# EAGLE schematic Alcohol_Detector_Project_Schematic (EAGLE 9.6.2)

## Sheet 1 of 7
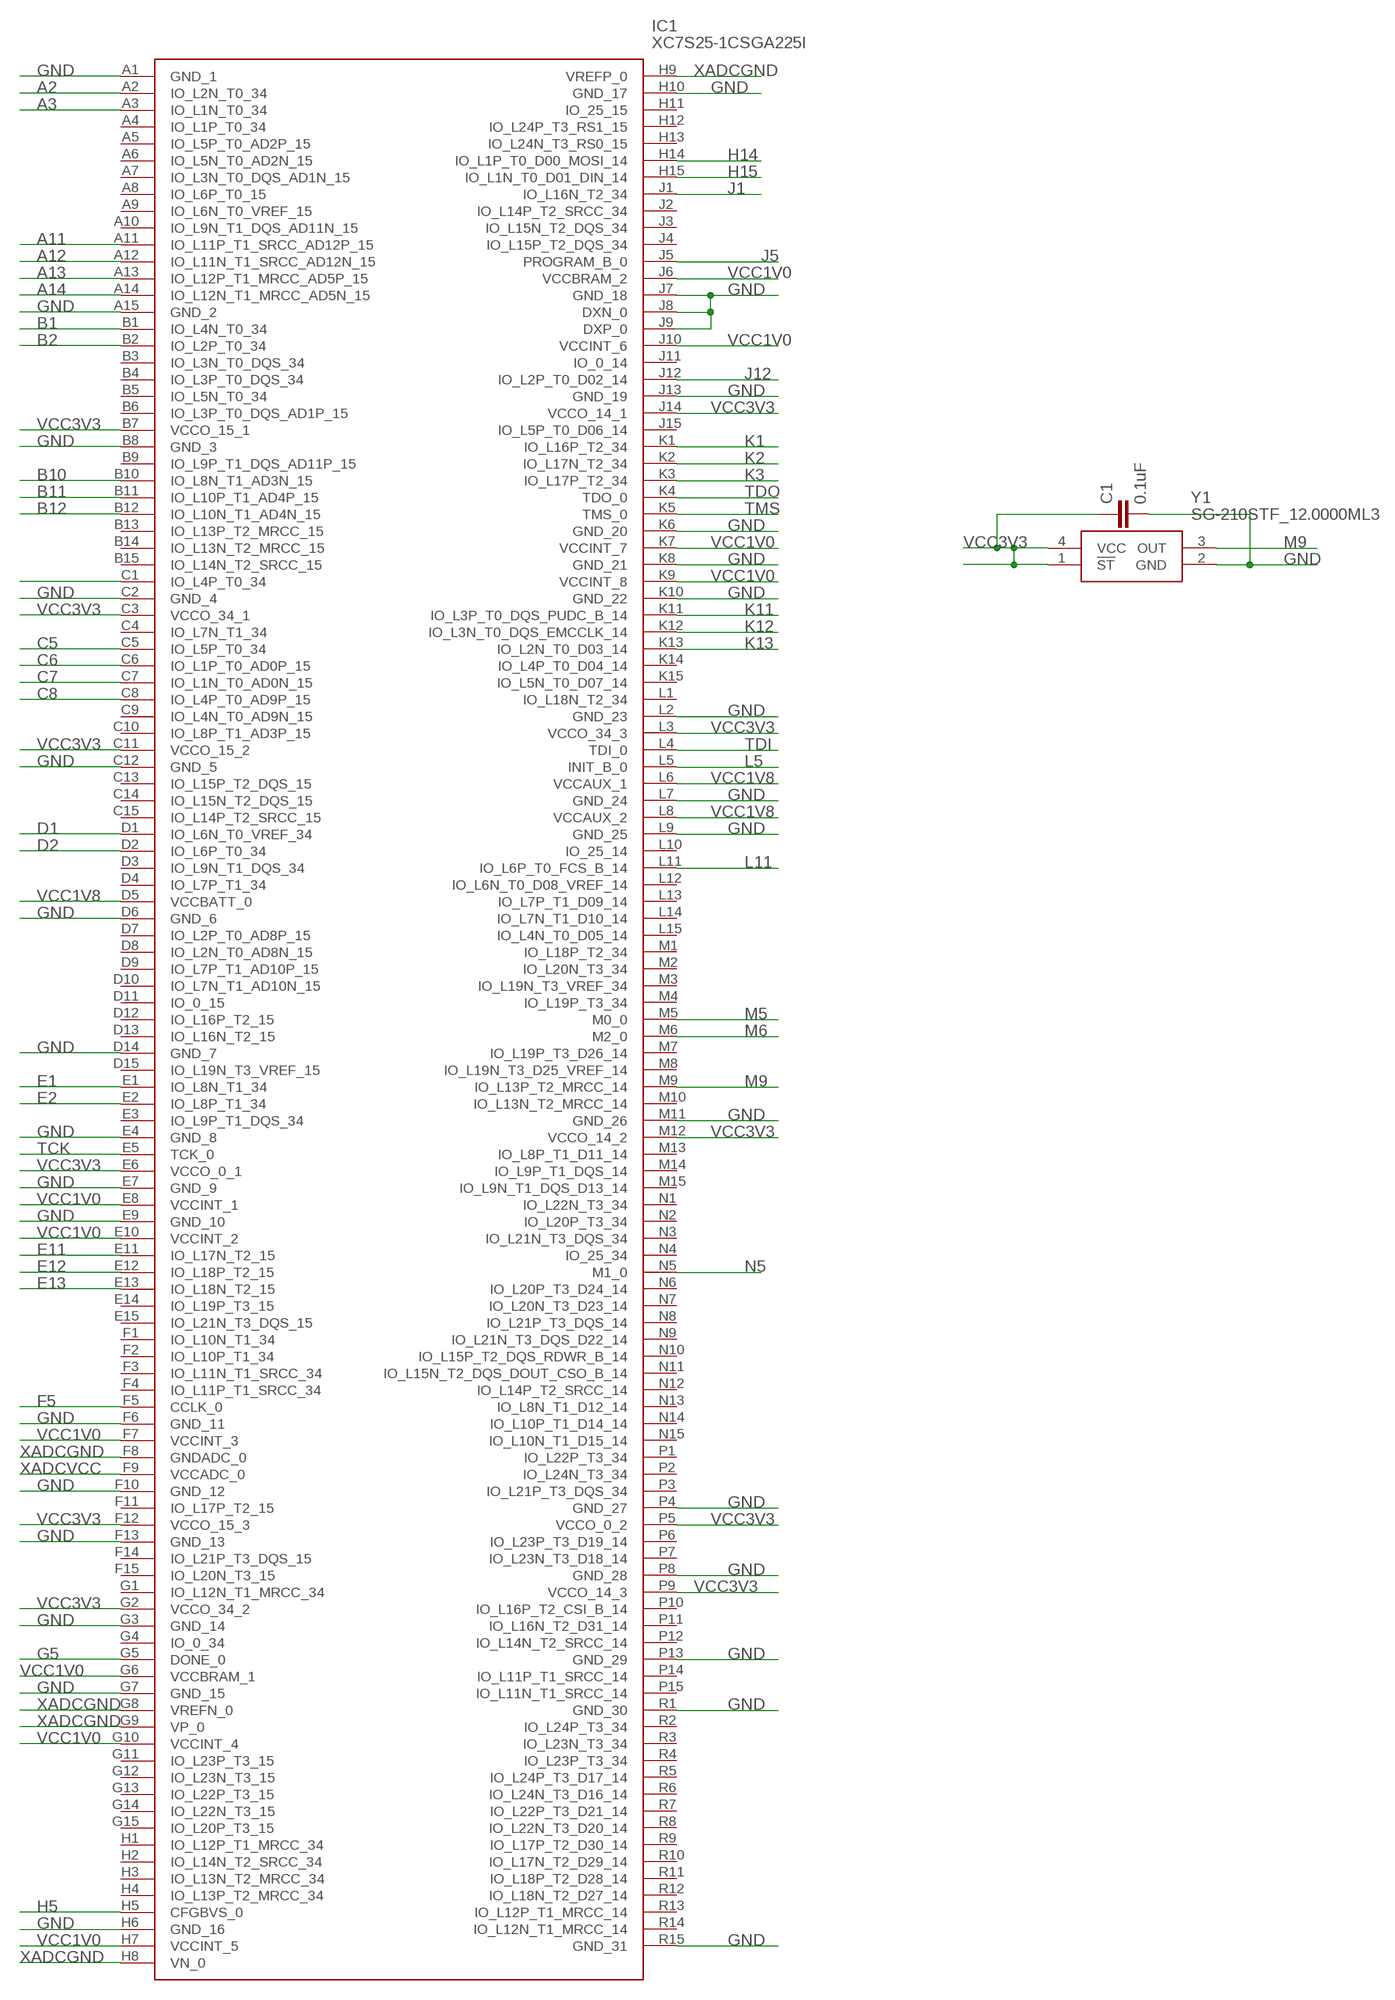
[diagram p0: schematic, sheet 1]

### Parts
C1  0.1uF  0.1UF-0402-6.3V-10%-X7R  [0402]
IC1  XC7S25-1CSGA225I  [BGA225C80P15X15_1300X1300X140]
Y1  SG-210STF_12.0000ML3  [SG210STF120000ML3]

### Nets
A2: IC1.A2(IO_L2N_T0_34) ; also sheet 6
A3: IC1.A3(IO_L1N_T0_34) ; also sheet 6
A11: IC1.A11(IO_L11P_T1_SRCC_AD12P_15) ; also sheet 5
A12: IC1.A12(IO_L11N_T1_SRCC_AD12N_15) ; also sheet 5
A13: IC1.A13(IO_L12P_T1_MRCC_AD5P_15) ; also sheet 5
A14: IC1.A14(IO_L12N_T1_MRCC_AD5N_15) ; also sheet 5
B1: IC1.B1(IO_L4N_T0_34) ; also sheet 7
B2: IC1.B2(IO_L2P_T0_34) ; also sheet 6
B10: IC1.B10(IO_L8N_T1_AD3N_15) ; also sheet 7
B11: IC1.B11(IO_L10P_T1_AD4P_15) ; also sheet 7
B12: IC1.B12(IO_L10N_T1_AD4N_15) ; also sheet 7
C5: IC1.C5(IO_L5P_T0_34) ; also sheet 7
C6: IC1.C6(IO_L1P_T0_AD0P_15) ; also sheet 7
C7: IC1.C7(IO_L1N_T0_AD0N_15) ; also sheet 7
C8: IC1.C8(IO_L4P_T0_AD9P_15) ; also sheet 7
D1: IC1.D1(IO_L6N_T0_VREF_34) ; also sheet 5
D2: IC1.D2(IO_L6P_T0_34) ; also sheet 5
E1: IC1.E1(IO_L8N_T1_34) ; also sheet 5
E2: IC1.E2(IO_L8P_T1_34) ; also sheet 5
E11: IC1.E11(IO_L17N_T2_15) ; also sheet 7
E12: IC1.E12(IO_L18P_T2_15) ; also sheet 7
E13: IC1.E13(IO_L18N_T2_15) ; also sheet 7
F5: IC1.F5(CCLK_0) ; also sheet 4
G5: IC1.G5(DONE_0) ; also sheet 4
GND: C1.2 IC1.A1(GND_1) IC1.A15(GND_2) IC1.B8(GND_3) IC1.C2(GND_4) IC1.C12(GND_5) IC1.D6(GND_6) IC1.D14(GND_7) IC1.E4(GND_8) IC1.E7(GND_9) IC1.E9(GND_10) IC1.F6(GND_11) IC1.F10(GND_12) IC1.F13(GND_13) IC1.G3(GND_14) IC1.G7(GND_15) IC1.H6(GND_16) IC1.H10(GND_17) IC1.J7(GND_18) IC1.J8(DXN_0) IC1.J9(DXP_0) IC1.J13(GND_19) IC1.K6(GND_20) IC1.K8(GND_21) IC1.K10(GND_22) IC1.L2(GND_23) IC1.L7(GND_24) IC1.L9(GND_25) IC1.M11(GND_26) IC1.P4(GND_27) IC1.P8(GND_28) IC1.P13(GND_29) IC1.R1(GND_30) IC1.R15(GND_31) Y1.2(GND) ; also sheet 2,3,4,5,6,7
H5: IC1.H5(CFGBVS_0) ; also sheet 4
H14: IC1.H14(IO_L1P_T0_D00_MOSI_14) ; also sheet 4
H15: IC1.H15(IO_L1N_T0_D01_DIN_14) ; also sheet 4
J1: IC1.J1(IO_L16N_T2_34) ; also sheet 5
J5: IC1.J5(PROGRAM_B_0) ; also sheet 4
J12: IC1.J12(IO_L2P_T0_D02_14) ; also sheet 4
K1: IC1.K1(IO_L16P_T2_34) ; also sheet 5
K2: IC1.K2(IO_L17N_T2_34) ; also sheet 5
K3: IC1.K3(IO_L17P_T2_34) ; also sheet 5
K11: IC1.K11(IO_L3P_T0_DQS_PUDC_B_14) ; also sheet 4
K12: IC1.K12(IO_L3N_T0_DQS_EMCCLK_14) ; also sheet 4
K13: IC1.K13(IO_L2N_T0_D03_14) ; also sheet 4
L5: IC1.L5(INIT_B_0) ; also sheet 4
L11: IC1.L11(IO_L6P_T0_FCS_B_14) ; also sheet 4
M5: IC1.M5(M0_0) ; also sheet 4
M6: IC1.M6(M2_0) ; also sheet 4
M9: IC1.M9(IO_L13P_T2_MRCC_14) Y1.3(OUT)
N5: IC1.N5(M1_0) ; also sheet 4
N$54: IC1.C1(IO_L4P_T0_34)
TCK: IC1.E5(TCK_0) ; also sheet 3
TDI: IC1.L4(TDI_0) ; also sheet 3
TDO: IC1.K4(TDO_0) ; also sheet 3
TMS: IC1.K5(TMS_0) ; also sheet 3
VCC1V0: IC1.E8(VCCINT_1) IC1.E10(VCCINT_2) IC1.F7(VCCINT_3) IC1.G6(VCCBRAM_1) IC1.G10(VCCINT_4) IC1.H7(VCCINT_5) IC1.J6(VCCBRAM_2) IC1.J10(VCCINT_6) IC1.K7(VCCINT_7) IC1.K9(VCCINT_8) ; also sheet 2,3
VCC1V8: IC1.D5(VCCBATT_0) IC1.L6(VCCAUX_1) IC1.L8(VCCAUX_2) ; also sheet 2,3
VCC3V3: C1.1 IC1.B7(VCCO_15_1) IC1.C3(VCCO_34_1) IC1.C11(VCCO_15_2) IC1.E6(VCCO_0_1) IC1.F12(VCCO_15_3) IC1.G2(VCCO_34_2) IC1.J14(VCCO_14_1) IC1.L3(VCCO_34_3) IC1.M12(VCCO_14_2) IC1.P5(VCCO_0_2) IC1.P9(VCCO_14_3) Y1.1(!ST) Y1.4(VCC) ; also sheet 2,3,4,5,6,7
XADCGND: IC1.F8(GNDADC_0) IC1.G8(VREFN_0) IC1.G9(VP_0) IC1.H8(VN_0) IC1.H9(VREFP_0) ; also sheet 2
XADCVCC: IC1.F9(VCCADC_0) ; also sheet 2
Unconnected: IC1.A4(IO_L1P_T0_34) IC1.A5(IO_L5P_T0_AD2P_15) IC1.A6(IO_L5N_T0_AD2N_15) IC1.A7(IO_L3N_T0_DQS_AD1N_15) IC1.A8(IO_L6P_T0_15) IC1.A9(IO_L6N_T0_VREF_15) IC1.A10(IO_L9N_T1_DQS_AD11N_15) IC1.B3(IO_L3N_T0_DQS_34) IC1.B4(IO_L3P_T0_DQS_34) IC1.B5(IO_L5N_T0_34) IC1.B6(IO_L3P_T0_DQS_AD1P_15) IC1.B9(IO_L9P_T1_DQS_AD11P_15) IC1.B13(IO_L13P_T2_MRCC_15) IC1.B14(IO_L13N_T2_MRCC_15) IC1.B15(IO_L14N_T2_SRCC_15) IC1.C4(IO_L7N_T1_34) IC1.C9(IO_L4N_T0_AD9N_15) IC1.C10(IO_L8P_T1_AD3P_15) IC1.C13(IO_L15P_T2_DQS_15) IC1.C14(IO_L15N_T2_DQS_15) IC1.C15(IO_L14P_T2_SRCC_15) IC1.D3(IO_L9N_T1_DQS_34) IC1.D4(IO_L7P_T1_34) IC1.D7(IO_L2P_T0_AD8P_15) IC1.D8(IO_L2N_T0_AD8N_15) IC1.D9(IO_L7P_T1_AD10P_15) IC1.D10(IO_L7N_T1_AD10N_15) IC1.D11(IO_0_15) IC1.D12(IO_L16P_T2_15) IC1.D13(IO_L16N_T2_15) IC1.D15(IO_L19N_T3_VREF_15) IC1.E3(IO_L9P_T1_DQS_34) IC1.E14(IO_L19P_T3_15) IC1.E15(IO_L21N_T3_DQS_15) IC1.F1(IO_L10N_T1_34) IC1.F2(IO_L10P_T1_34) IC1.F3(IO_L11N_T1_SRCC_34) IC1.F4(IO_L11P_T1_SRCC_34) IC1.F11(IO_L17P_T2_15) IC1.F14(IO_L21P_T3_DQS_15) IC1.F15(IO_L20N_T3_15) IC1.G1(IO_L12N_T1_MRCC_34) IC1.G4(IO_0_34) IC1.G11(IO_L23P_T3_15) IC1.G12(IO_L23N_T3_15) IC1.G13(IO_L22P_T3_15) IC1.G14(IO_L22N_T3_15) IC1.G15(IO_L20P_T3_15) IC1.H1(IO_L12P_T1_MRCC_34) IC1.H2(IO_L14N_T2_SRCC_34) IC1.H3(IO_L13N_T2_MRCC_34) IC1.H4(IO_L13P_T2_MRCC_34) IC1.H11(IO_25_15) IC1.H12(IO_L24P_T3_RS1_15) IC1.H13(IO_L24N_T3_RS0_15) IC1.J2(IO_L14P_T2_SRCC_34) IC1.J3(IO_L15N_T2_DQS_34) IC1.J4(IO_L15P_T2_DQS_34) IC1.J11(IO_0_14) IC1.J15(IO_L5P_T0_D06_14) IC1.K14(IO_L4P_T0_D04_14) IC1.K15(IO_L5N_T0_D07_14) IC1.L1(IO_L18N_T2_34) IC1.L10(IO_25_14) IC1.L12(IO_L6N_T0_D08_VREF_14) IC1.L13(IO_L7P_T1_D09_14) IC1.L14(IO_L7N_T1_D10_14) IC1.L15(IO_L4N_T0_D05_14) IC1.M1(IO_L18P_T2_34) IC1.M2(IO_L20N_T3_34) IC1.M3(IO_L19N_T3_VREF_34) IC1.M4(IO_L19P_T3_34) IC1.M7(IO_L19P_T3_D26_14) IC1.M8(IO_L19N_T3_D25_VREF_14) IC1.M10(IO_L13N_T2_MRCC_14) IC1.M13(IO_L8P_T1_D11_14) IC1.M14(IO_L9P_T1_DQS_14) IC1.M15(IO_L9N_T1_DQS_D13_14) IC1.N1(IO_L22N_T3_34) IC1.N2(IO_L20P_T3_34) IC1.N3(IO_L21N_T3_DQS_34) IC1.N4(IO_25_34) IC1.N6(IO_L20P_T3_D24_14) IC1.N7(IO_L20N_T3_D23_14) IC1.N8(IO_L21P_T3_DQS_14) IC1.N9(IO_L21N_T3_DQS_D22_14) IC1.N10(IO_L15P_T2_DQS_RDWR_B_14) IC1.N11(IO_L15N_T2_DQS_DOUT_CSO_B_14) IC1.N12(IO_L14P_T2_SRCC_14) IC1.N13(IO_L8N_T1_D12_14) IC1.N14(IO_L10P_T1_D14_14) IC1.N15(IO_L10N_T1_D15_14) IC1.P1(IO_L22P_T3_34) IC1.P2(IO_L24N_T3_34) IC1.P3(IO_L21P_T3_DQS_34) IC1.P6(IO_L23P_T3_D19_14) IC1.P7(IO_L23N_T3_D18_14) IC1.P10(IO_L16P_T2_CSI_B_14) IC1.P11(IO_L16N_T2_D31_14) IC1.P12(IO_L14N_T2_SRCC_14) IC1.P14(IO_L11P_T1_SRCC_14) IC1.P15(IO_L11N_T1_SRCC_14) IC1.R2(IO_L24P_T3_34) IC1.R3(IO_L23N_T3_34) IC1.R4(IO_L23P_T3_34) IC1.R5(IO_L24P_T3_D17_14) IC1.R6(IO_L24N_T3_D16_14) IC1.R7(IO_L22P_T3_D21_14) IC1.R8(IO_L22N_T3_D20_14) IC1.R9(IO_L17P_T2_D30_14) IC1.R10(IO_L17N_T2_D29_14) IC1.R11(IO_L18P_T2_D28_14) IC1.R12(IO_L18N_T2_D27_14) IC1.R13(IO_L12P_T1_MRCC_14) IC1.R14(IO_L12N_T1_MRCC_14)

## Sheet 2 of 7
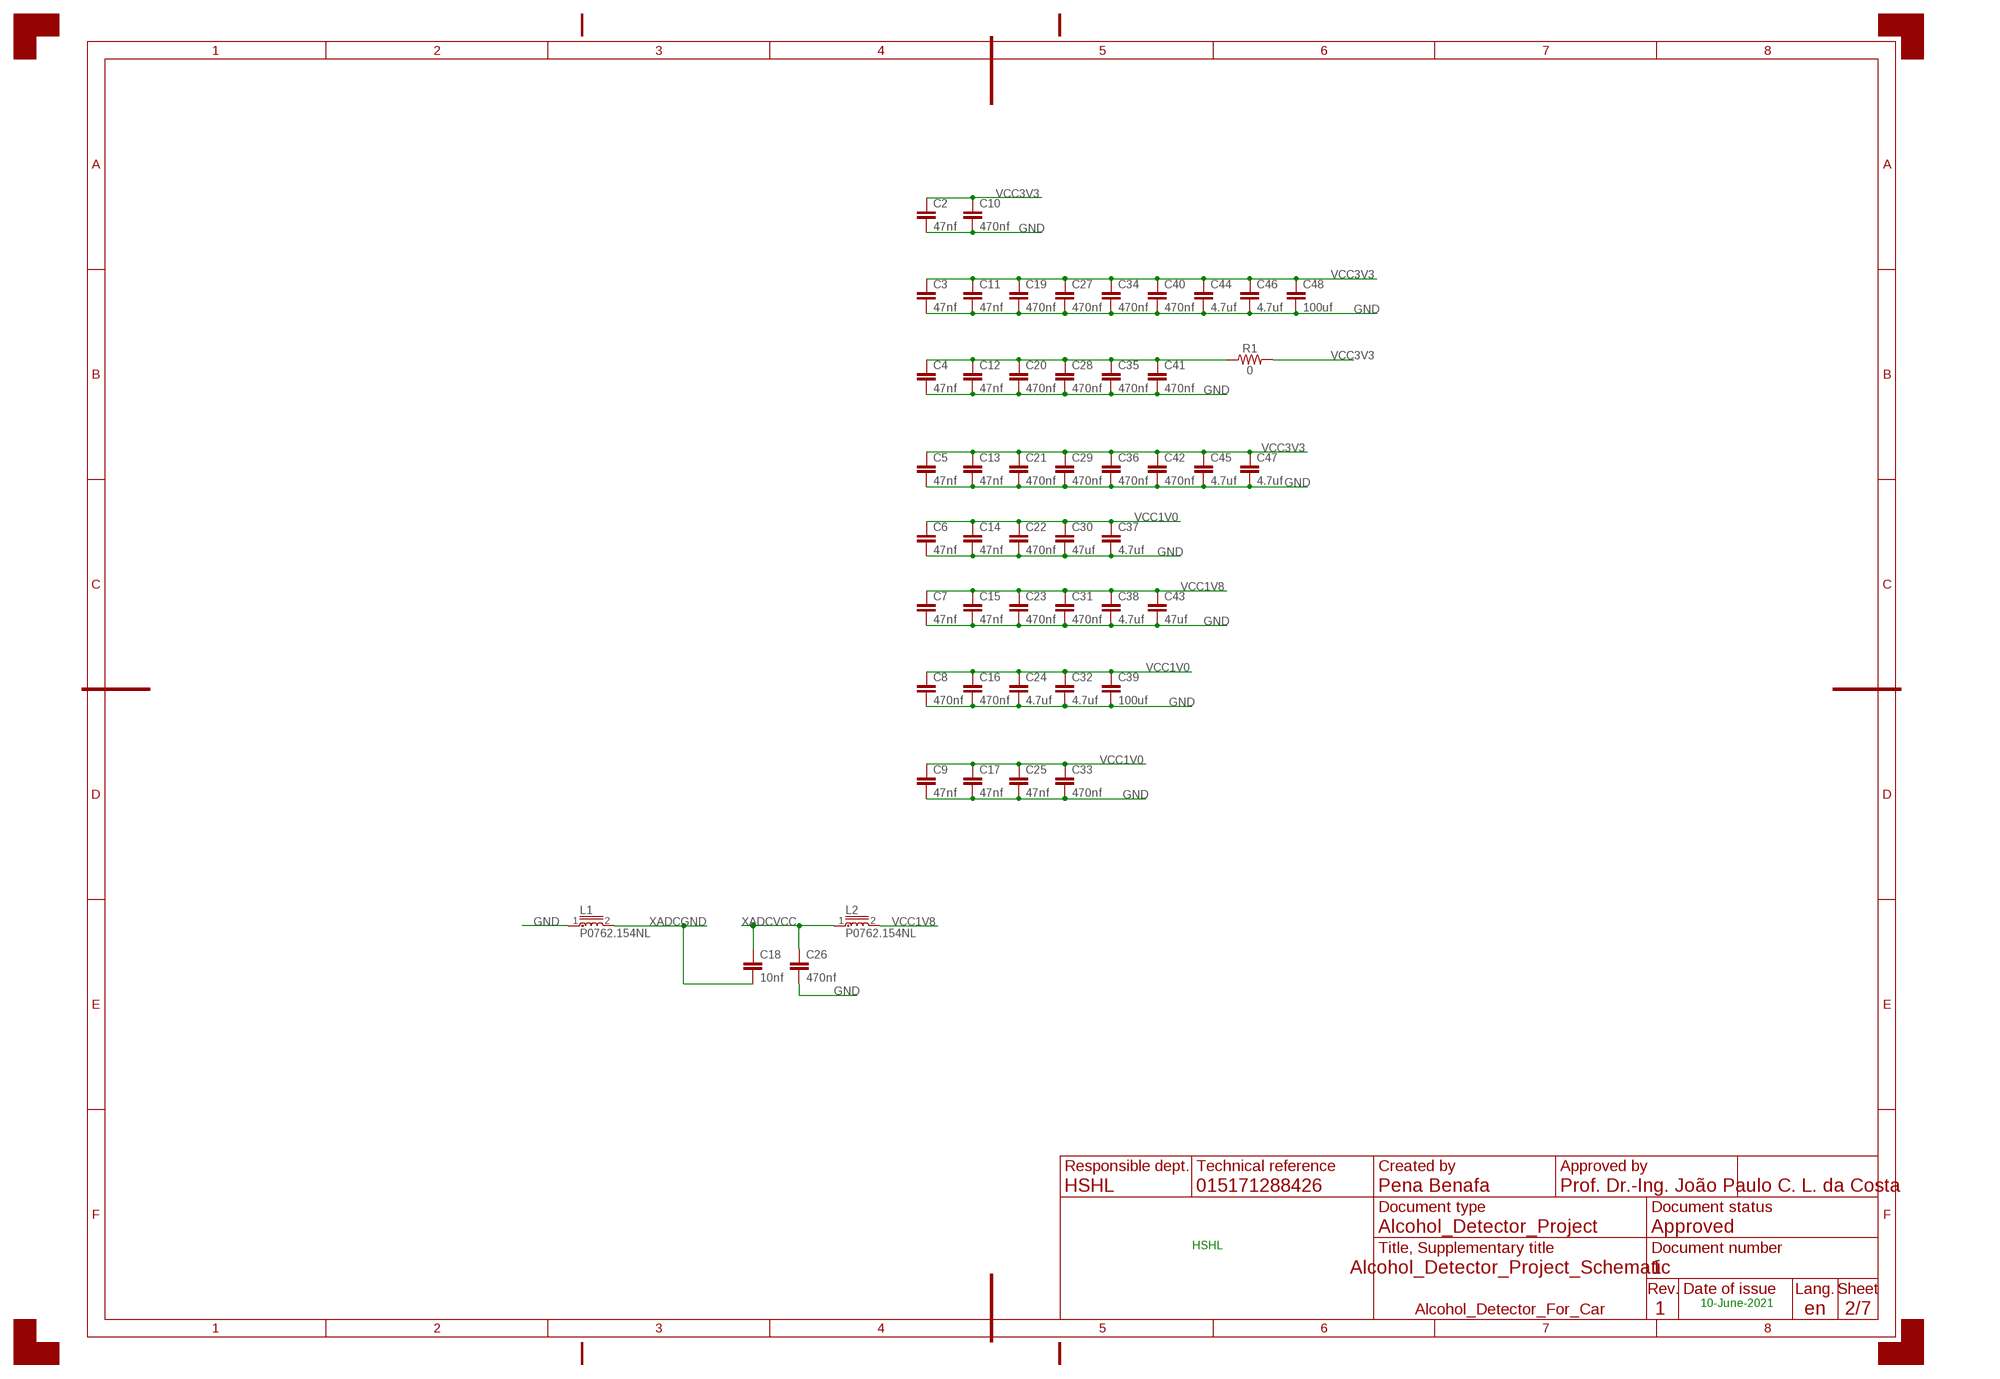
[diagram p1: schematic, sheet 2]
FRAME1 (A3_L_DOCFIELD_EN): APPROVAL_PERSON: Prof. Dr.-Ing. João Paulo C. L. da Costa; CREATOR: Pena Benafa; DOCUMENT_NUMBER: 1; DOCUMENT_STATUS: Approved; DOCUMENT_TYPE: Alcohol_Detector_Project; LANGUAGE: en; RESPONSIBLE_DEPARTMENT: HSHL; REVISION_LEVEL: 1; SUPPLEMENTARY_TITLE: Alcohol_Detector_For_Car; TECHNICAL_REFERENCE: 015171288426

### Parts
C2  47nf  C2,5-3  [C2.5-3]
C3  47nf  C2,5-3  [C2.5-3]
C4  47nf  C2,5-3  [C2.5-3]
C5  47nf  C2,5-3  [C2.5-3]
C6  47nf  C2,5-3  [C2.5-3]
C7  47nf  C2,5-3  [C2.5-3]
C8  470nf  C2,5-3  [C2.5-3]
C9  47nf  C2,5-3  [C2.5-3]
C10  470nf  C2,5-3  [C2.5-3]
C11  47nf  C2,5-3  [C2.5-3]
C12  47nf  C2,5-3  [C2.5-3]
C13  47nf  C2,5-3  [C2.5-3]
C14  47nf  C2,5-3  [C2.5-3]
C15  47nf  C2,5-3  [C2.5-3]
C16  470nf  C2,5-3  [C2.5-3]
C17  47nf  C2,5-3  [C2.5-3]
C18  10nf  C2,5-3  [C2.5-3]
C19  470nf  C2,5-3  [C2.5-3]
C20  470nf  C2,5-3  [C2.5-3]
C21  470nf  C2,5-3  [C2.5-3]
C22  470nf  C2,5-3  [C2.5-3]
C23  470nf  C2,5-3  [C2.5-3]
C24  4.7uf  C2,5-3  [C2.5-3]
C25  47nf  C2,5-3  [C2.5-3]
C26  470nf  C2,5-3  [C2.5-3]
C27  470nf  C2,5-3  [C2.5-3]
C28  470nf  C2,5-3  [C2.5-3]
C29  470nf  C2,5-3  [C2.5-3]
C30  47uf  C2,5-3  [C2.5-3]
C31  470nf  C2,5-3  [C2.5-3]
C32  4.7uf  C2,5-3  [C2.5-3]
C33  470nf  C2,5-3  [C2.5-3]
C34  470nf  C2,5-3  [C2.5-3]
C35  470nf  C2,5-3  [C2.5-3]
C36  470nf  C2,5-3  [C2.5-3]
C37  4.7uf  C2,5-3  [C2.5-3]
C38  4.7uf  C2,5-3  [C2.5-3]
C39  100uf  C2,5-3  [C2.5-3]
C40  470nf  C2,5-3  [C2.5-3]
C41  470nf  C2,5-3  [C2.5-3]
C42  470nf  C2,5-3  [C2.5-3]
C43  47uf  C2,5-3  [C2.5-3]
C44  4.7uf  C2,5-3  [C2.5-3]
C45  4.7uf  C2,5-3  [C2.5-3]
C46  4.7uf  C2,5-3  [C2.5-3]
C47  4.7uf  C2,5-3  [C2.5-3]
C48  100uf  C2,5-3  [C2.5-3]
L1  P0762.154NL  [P0762NL]
L2  P0762.154NL  [P0762NL]
R1  0  0OHM-0402-1/10W  [0402]

### Nets
GND: C2.2 C3.2 C4.2 C5.2 C6.2 C7.2 C8.2 C9.2 C10.2 C11.2 C12.2 C13.2 C14.2 C15.2 C16.2 C17.2 C19.2 C20.2 C21.2 C22.2 C23.2 C24.2 C25.2 C26.2 C27.2 C28.2 C29.2 C30.2 C31.2 C32.2 C33.2 C34.2 C35.2 C36.2 C37.2 C38.2 C39.2 C40.2 C41.2 C42.2 C43.2 C44.2 C45.2 C46.2 C47.2 C48.2 L1.1 ; also sheet 1,3,4,5,6,7
N$5: C4.1 C12.1 C20.1 C28.1 C35.1 C41.1 R1.1
VCC1V0: C6.1 C8.1 C9.1 C14.1 C16.1 C17.1 C22.1 C24.1 C25.1 C30.1 C32.1 C33.1 C37.1 C39.1 ; also sheet 1,3
VCC1V8: C7.1 C15.1 C23.1 C31.1 C38.1 C43.1 L2.2 ; also sheet 1,3
VCC3V3: C2.1 C3.1 C5.1 C10.1 C11.1 C13.1 C19.1 C21.1 C27.1 C29.1 C34.1 C36.1 C40.1 C42.1 C44.1 C45.1 C46.1 C47.1 C48.1 R1.2 ; also sheet 1,3,4,5,6,7
XADCGND: C18.2 L1.2 ; also sheet 1
XADCVCC: C18.1 C26.1 L2.1 ; also sheet 1

### Notes on the sheet
- HSHL
- 10-June-2021

## Sheet 3 of 7
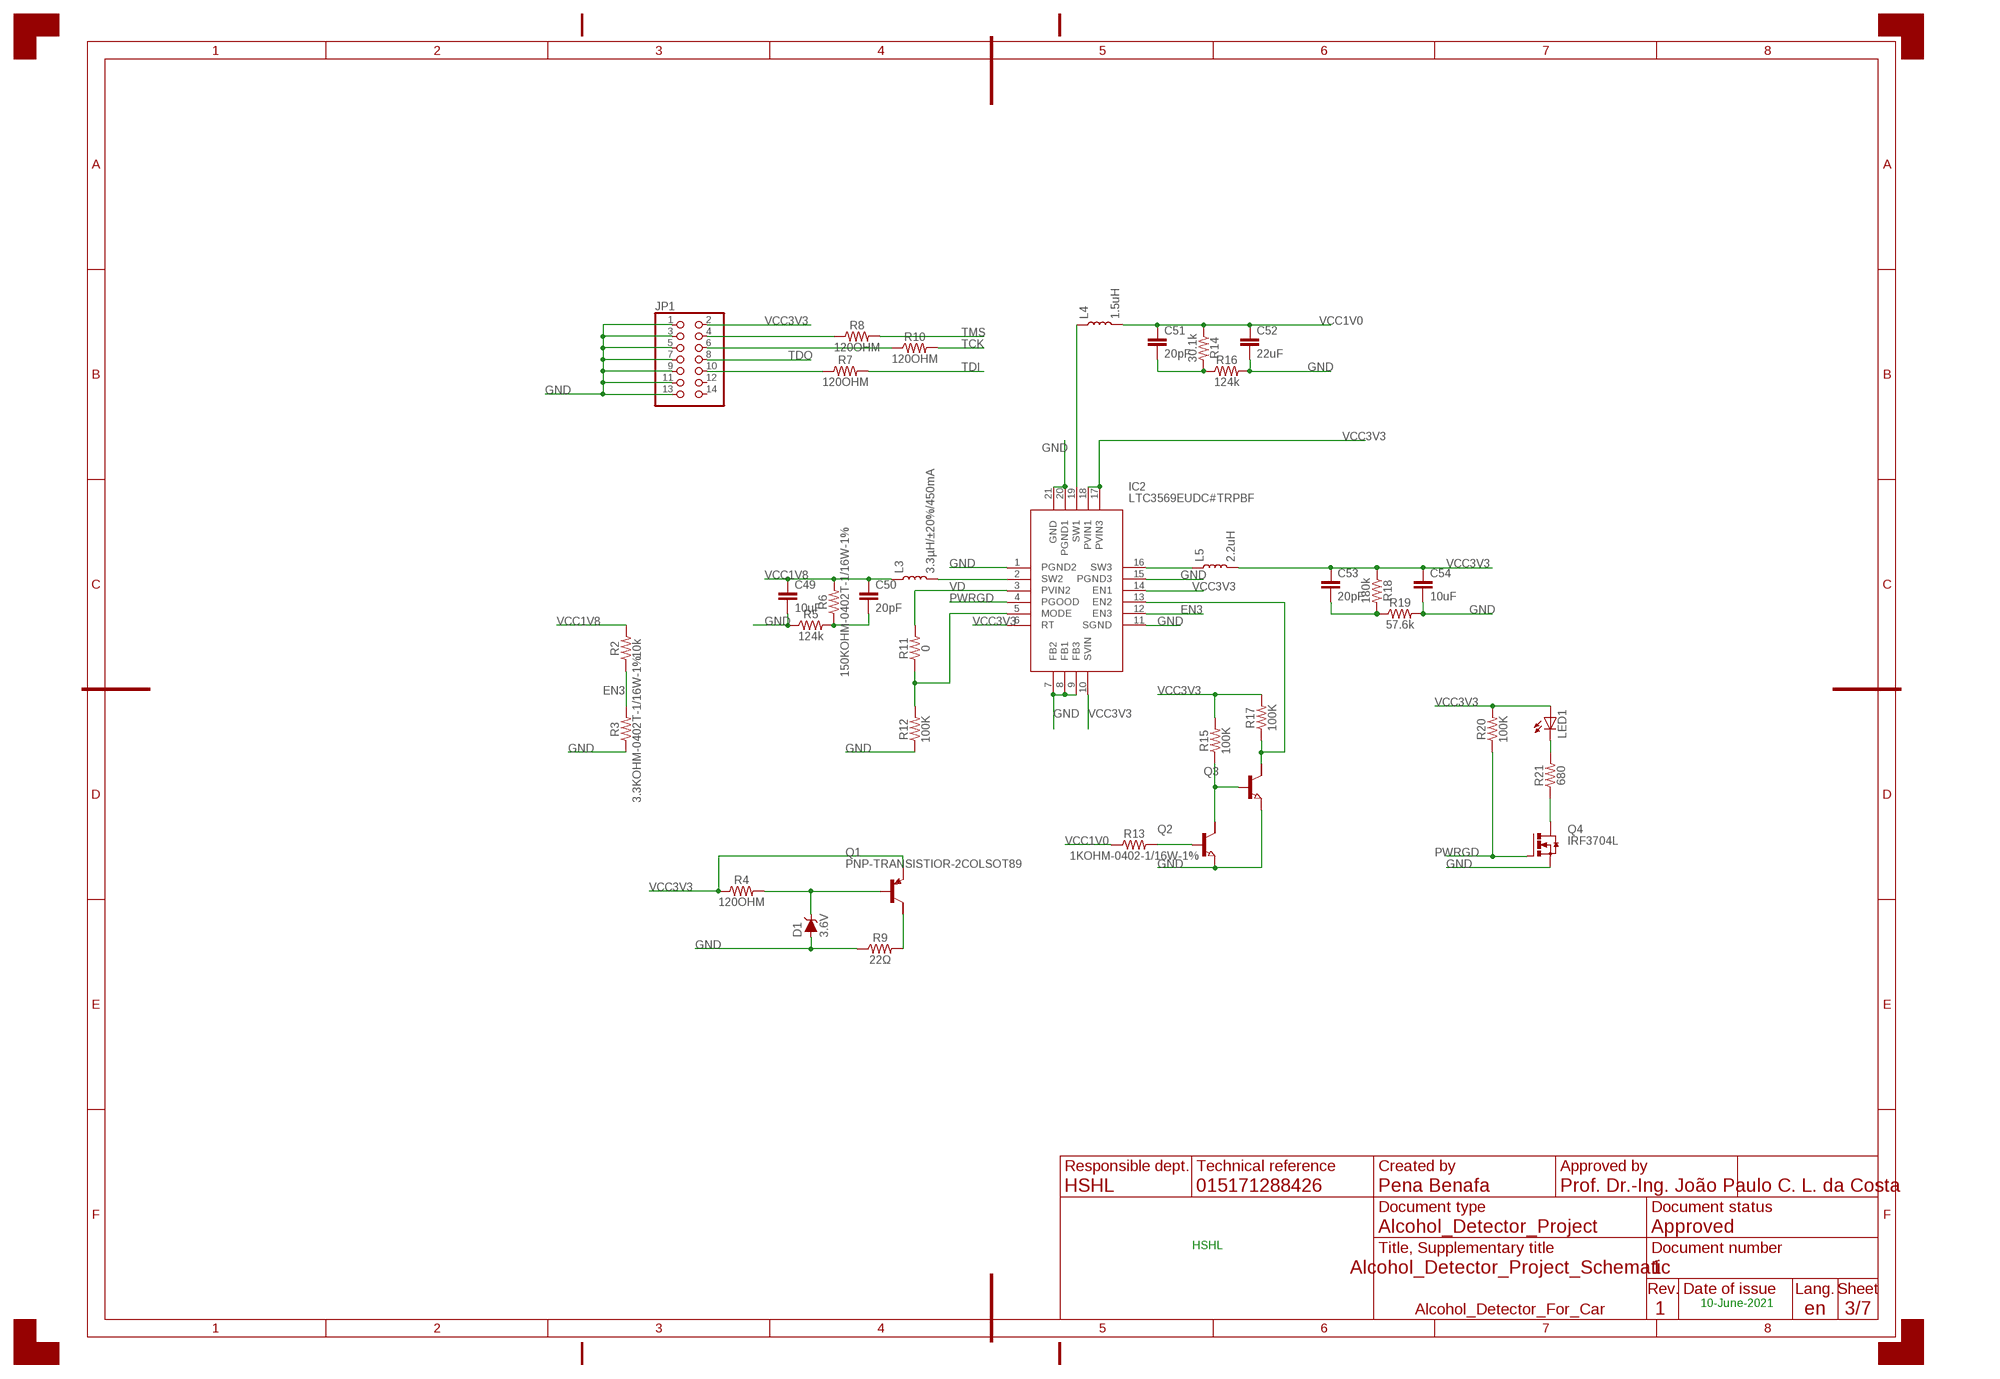
[diagram p2: schematic, sheet 3]
FRAME2 (A3_L_DOCFIELD_EN): APPROVAL_PERSON: Prof. Dr.-Ing. João Paulo C. L. da Costa; CREATOR: Pena Benafa; DOCUMENT_NUMBER: 1; DOCUMENT_STATUS: Approved; DOCUMENT_TYPE: Alcohol_Detector_Project; LANGUAGE: en; RESPONSIBLE_DEPARTMENT: HSHL; REVISION_LEVEL: 1; SUPPLEMENTARY_TITLE: Alcohol_Detector_For_Car; TECHNICAL_REFERENCE: 015171288426

### Parts
C49  10uF  10UF-0402T-6.3V-20%  [0402-TIGHT]
C50  20pF  20PF-0402T-50V-5%  [0402-TIGHT]
C51  20pF  20PF-0402T-50V-5%  [0402-TIGHT]
C52  22uF  22UF-0603-6.3V-20%  [0603]
C53  20pF  20PF-0402T-50V-5%  [0402-TIGHT]
C54  10uF  10UF-0402T-6.3V-20%  [0402-TIGHT]
D1  3.6V  DIODE-ZENER-BZT52C3V6S  [SOD-323]
IC2  LTC3569EUDC#TRPBF  [QFN50P300X400X80-21N]
JP1  PINHD-2X7/90  [2X07/90]
L3  3.3µH/±20%/450mA  INDUCTOR-0805-3.3UH  [0805]
L4  1.5uH  1.5UH-2X2-1.4A  [INDUCTOR_2X2]
L5  2.2uH  INDUCTOR-0805_WIDE-2.2UH  [0805-WIDE]
LED1  LEDB152  [Q62902-B152]
Q1  PNP-TRANSISTIOR-2COLSOT89  [SOT89]
Q2  NPN-TRANSISTIOR-2COLSOT89  [SOT89]
Q3  NPN-TRANSISTIOR-2COLSOT89  [SOT89]
Q4  IRF3704L  [TO262-H]
R2  10k  10KOHM-0402T-1/16W-1%  [0402-TIGHT]
R3  3.3KOHM-0402T-1/16W-1%  [0402-TIGHT]
R4  120OHM  [0603]
R5  124k  124KOHM  [0603]
R6  150KOHM-0402T-1/16W-1%  [0402-TIGHT]
R7  120OHM  [0603]
R8  120OHM  [0603]
R9  22Ω  22OHM-0402-1/10W-1%  [0402]
R10  120OHM  [0603]
R11  0  0OHM-0402-1/10W  [0402]
R12  100K  100KOHM-0402-1/16W-1%  [0402]
R13  1KOHM-0402-1/16W-1%  [0402]
R14  30.1k  30.1KOHM-0603-1/10W-1%  [0603]
R15  100K  100KOHM-0402-1/16W-1%  [0402]
R16  124k  124KOHM  [0603]
R17  100K  100KOHM-0402-1/16W-1%  [0402]
R18  180k  180KOHM-0603-1/10W-1%  [0603]
R19  57.6k  57.6KOHM  [0603]
R20  100K  100KOHM-0402-1/16W-1%  [0402]
R21  680  680OHM-0603-1/10W-5%  [0603]

### Nets
EN3: IC2.12(EN3) R2.1 R3.2
GND: C49.2 C50.2 C52.2 C53.2 C54.2 D1.A IC2.1(PGND2) IC2.7(FB2) IC2.8(FB1) IC2.9(FB3) IC2.11(SGND) IC2.15(PGND3) IC2.20(PGND1) IC2.21(GND) JP1.1 JP1.3 JP1.5 JP1.7 JP1.9 JP1.11 JP1.13 Q2.3(E) Q3.3(E) Q4.3(S) R3.1 R5.1 R5.2 R6.1 R9.1 R12.1 R16.2 R18.2 R19.1 R19.2 ; also sheet 1,2,4,5,6,7
N$1: IC2.19(SW1) L4.P$1
N$2: IC2.2(SW2) L3.2
N$3: C51.2 R14.2 R16.1
N$4: IC2.16(SW3) L5.1
N$6: IC2.5(MODE) R11.1 R12.2
N$7: LED1.K(C) R21.2
N$8: Q2.2(C) Q3.1(B) R15.1
N$9: IC2.13(EN2) Q3.2(C) R17.1
N$10: Q2.1(B) R13.2
N$11: Q4.2(D) R21.1
N$12: D1.C Q1.1(B) R4.2
N$13: Q1.2(C) R9.2
N$38: JP1.4 R8.1
N$40: JP1.6 R10.1
N$42: JP1.10 R7.1
PWRGD: IC2.4(PGOOD) Q4.1(G) R20.1
TCK: R10.2 ; also sheet 1
TDI: R7.2 ; also sheet 1
TDO: JP1.8 ; also sheet 1
TMS: R8.2 ; also sheet 1
VCC1V0: C51.1 C52.1 L4.P$2 R13.1 R14.1 ; also sheet 1,2
VCC1V8: C49.1 C50.1 L3.1 R2.2 R6.2 ; also sheet 1,2
VCC3V3: C53.1 C54.1 IC2.6(RT) IC2.10(SVIN) IC2.14(EN1) IC2.17(PVIN3) IC2.18(PVIN1) JP1.2 L5.2 LED1.A Q1.3(E) R4.1 R15.2 R17.2 R18.1 R20.2 ; also sheet 1,2,4,5,6,7
VD: IC2.3(PVIN2) R11.2
Unconnected: JP1.12 JP1.14 Q1.2@1(C/) Q2.2@1(C/) Q3.2@1(C/)

### Notes on the sheet
- HSHL
- 10-June-2021

## Sheet 4 of 7
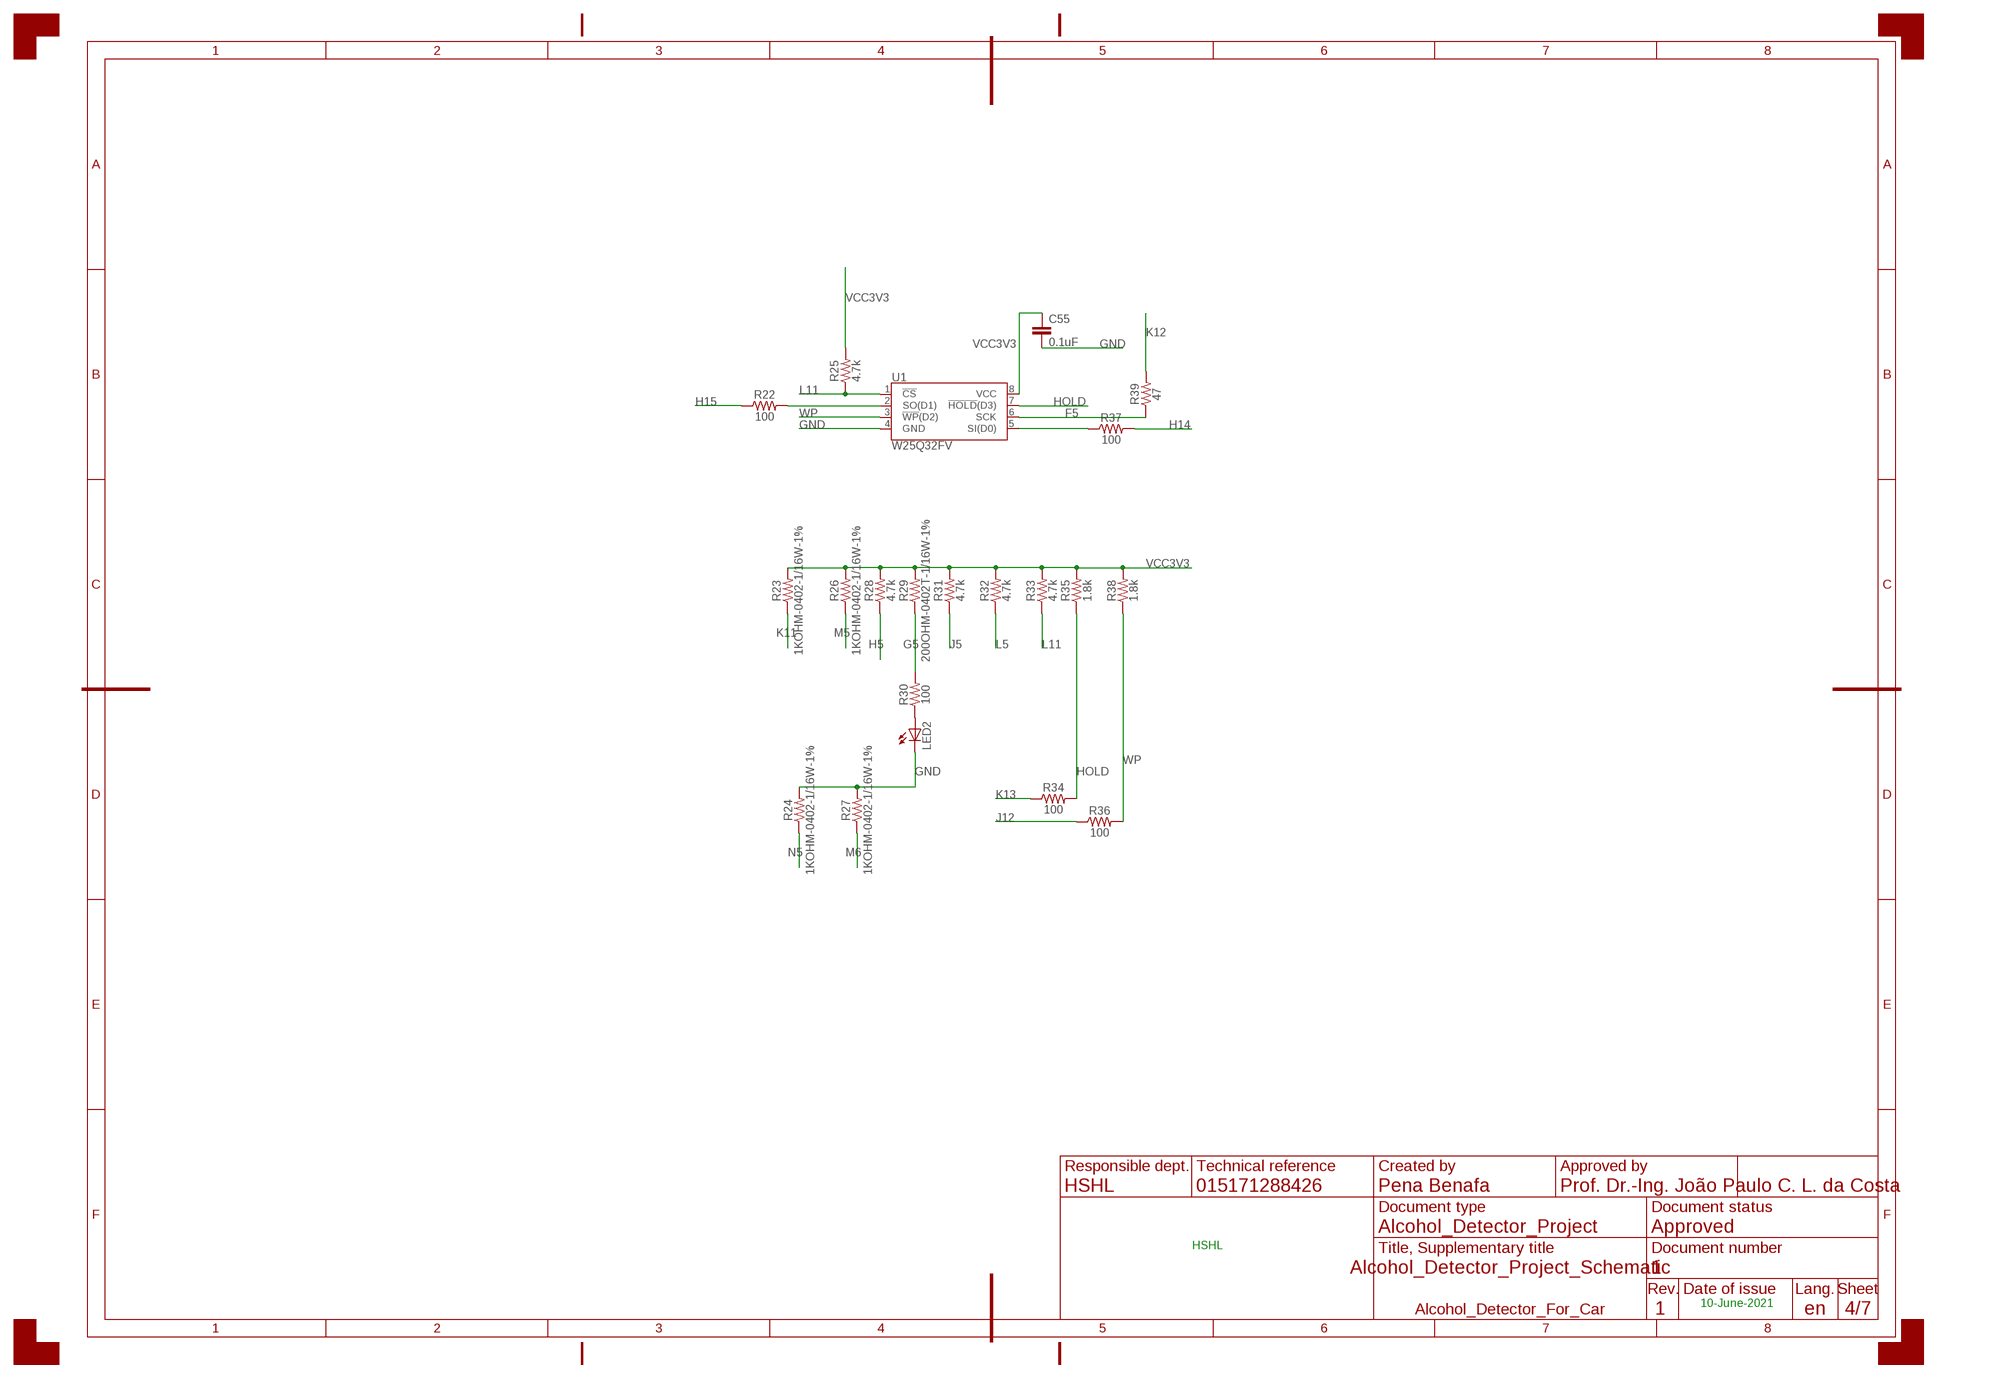
[diagram p3: schematic, sheet 4]
FRAME3 (A3_L_DOCFIELD_EN): APPROVAL_PERSON: Prof. Dr.-Ing. João Paulo C. L. da Costa; CREATOR: Pena Benafa; DOCUMENT_NUMBER: 1; DOCUMENT_STATUS: Approved; DOCUMENT_TYPE: Alcohol_Detector_Project; LANGUAGE: en; RESPONSIBLE_DEPARTMENT: HSHL; REVISION_LEVEL: 1; SUPPLEMENTARY_TITLE: Alcohol_Detector_For_Car; TECHNICAL_REFERENCE: 015171288426

### Parts
C55  0.1uF  0.1UF-0402-6.3V-10%-X7R  [0402]
LED2  LEDB152  [Q62902-B152]
R22  100  100OHM-0603-1/10W-1%  [0603]
R23  1KOHM-0402-1/16W-1%  [0402]
R24  1KOHM-0402-1/16W-1%  [0402]
R25  4.7k  4.7KOHM-0402T-1/16W-1%  [0402-TIGHT]
R26  1KOHM-0402-1/16W-1%  [0402]
R27  1KOHM-0402-1/16W-1%  [0402]
R28  4.7k  4.7KOHM-0402T-1/16W-1%  [0402-TIGHT]
R29  200OHM-0402T-1/16W-1%  [0402-TIGHT]
R30  100  100OHM-0603-1/10W-1%  [0603]
R31  4.7k  4.7KOHM-0402T-1/16W-1%  [0402-TIGHT]
R32  4.7k  4.7KOHM-0402T-1/16W-1%  [0402-TIGHT]
R33  4.7k  4.7KOHM-0402T-1/16W-1%  [0402-TIGHT]
R34  100  100OHM-0603-1/10W-1%  [0603]
R35  1.8k  1.8KOHM-0603-1/10W-1%  [0603]
R36  100  100OHM-0603-1/10W-1%  [0603]
R37  100  100OHM-0603-1/10W-1%  [0603]
R38  1.8k  1.8KOHM-0603-1/10W-1%  [0603]
R39  47  47OHM-0603-1/10W-1%  [0603]
U1  W25Q32FV  W25Q32FVSS  [SOIC-8]

### Nets
F5: R39.1 U1.6(SCK) ; also sheet 1
G5: R29.1 R30.2 ; also sheet 1
GND: C55.2 LED2.K(C) R24.2 R27.2 U1.4(GND) ; also sheet 1,2,3,5,6,7
H5: R28.1 ; also sheet 1
H14: R37.2 ; also sheet 1
H15: R22.1 ; also sheet 1
HOLD: R34.2 R35.1 U1.7(!HOLD!(D3))
J5: R31.1 ; also sheet 1
J12: R36.1 ; also sheet 1
K11: R23.1 ; also sheet 1
K12: R39.2 ; also sheet 1
K13: R34.1 ; also sheet 1
L5: R32.1 ; also sheet 1
L11: R25.1 R33.1 U1.1(!CS!) ; also sheet 1
M5: R26.1 ; also sheet 1
M6: R27.1 ; also sheet 1
N5: R24.1 ; also sheet 1
N$15: LED2.A R30.1
N$16: R22.2 U1.2(SO(D1))
N$17: R37.1 U1.5(SI(D0))
VCC3V3: C55.1 R23.2 R25.2 R26.2 R28.2 R29.2 R31.2 R32.2 R33.2 R35.2 R38.2 U1.8(VCC) ; also sheet 1,2,3,5,6,7
WP: R36.2 R38.1 U1.3(!WP!(D2))

### Notes on the sheet
- HSHL
- 10-June-2021

## Sheet 5 of 7
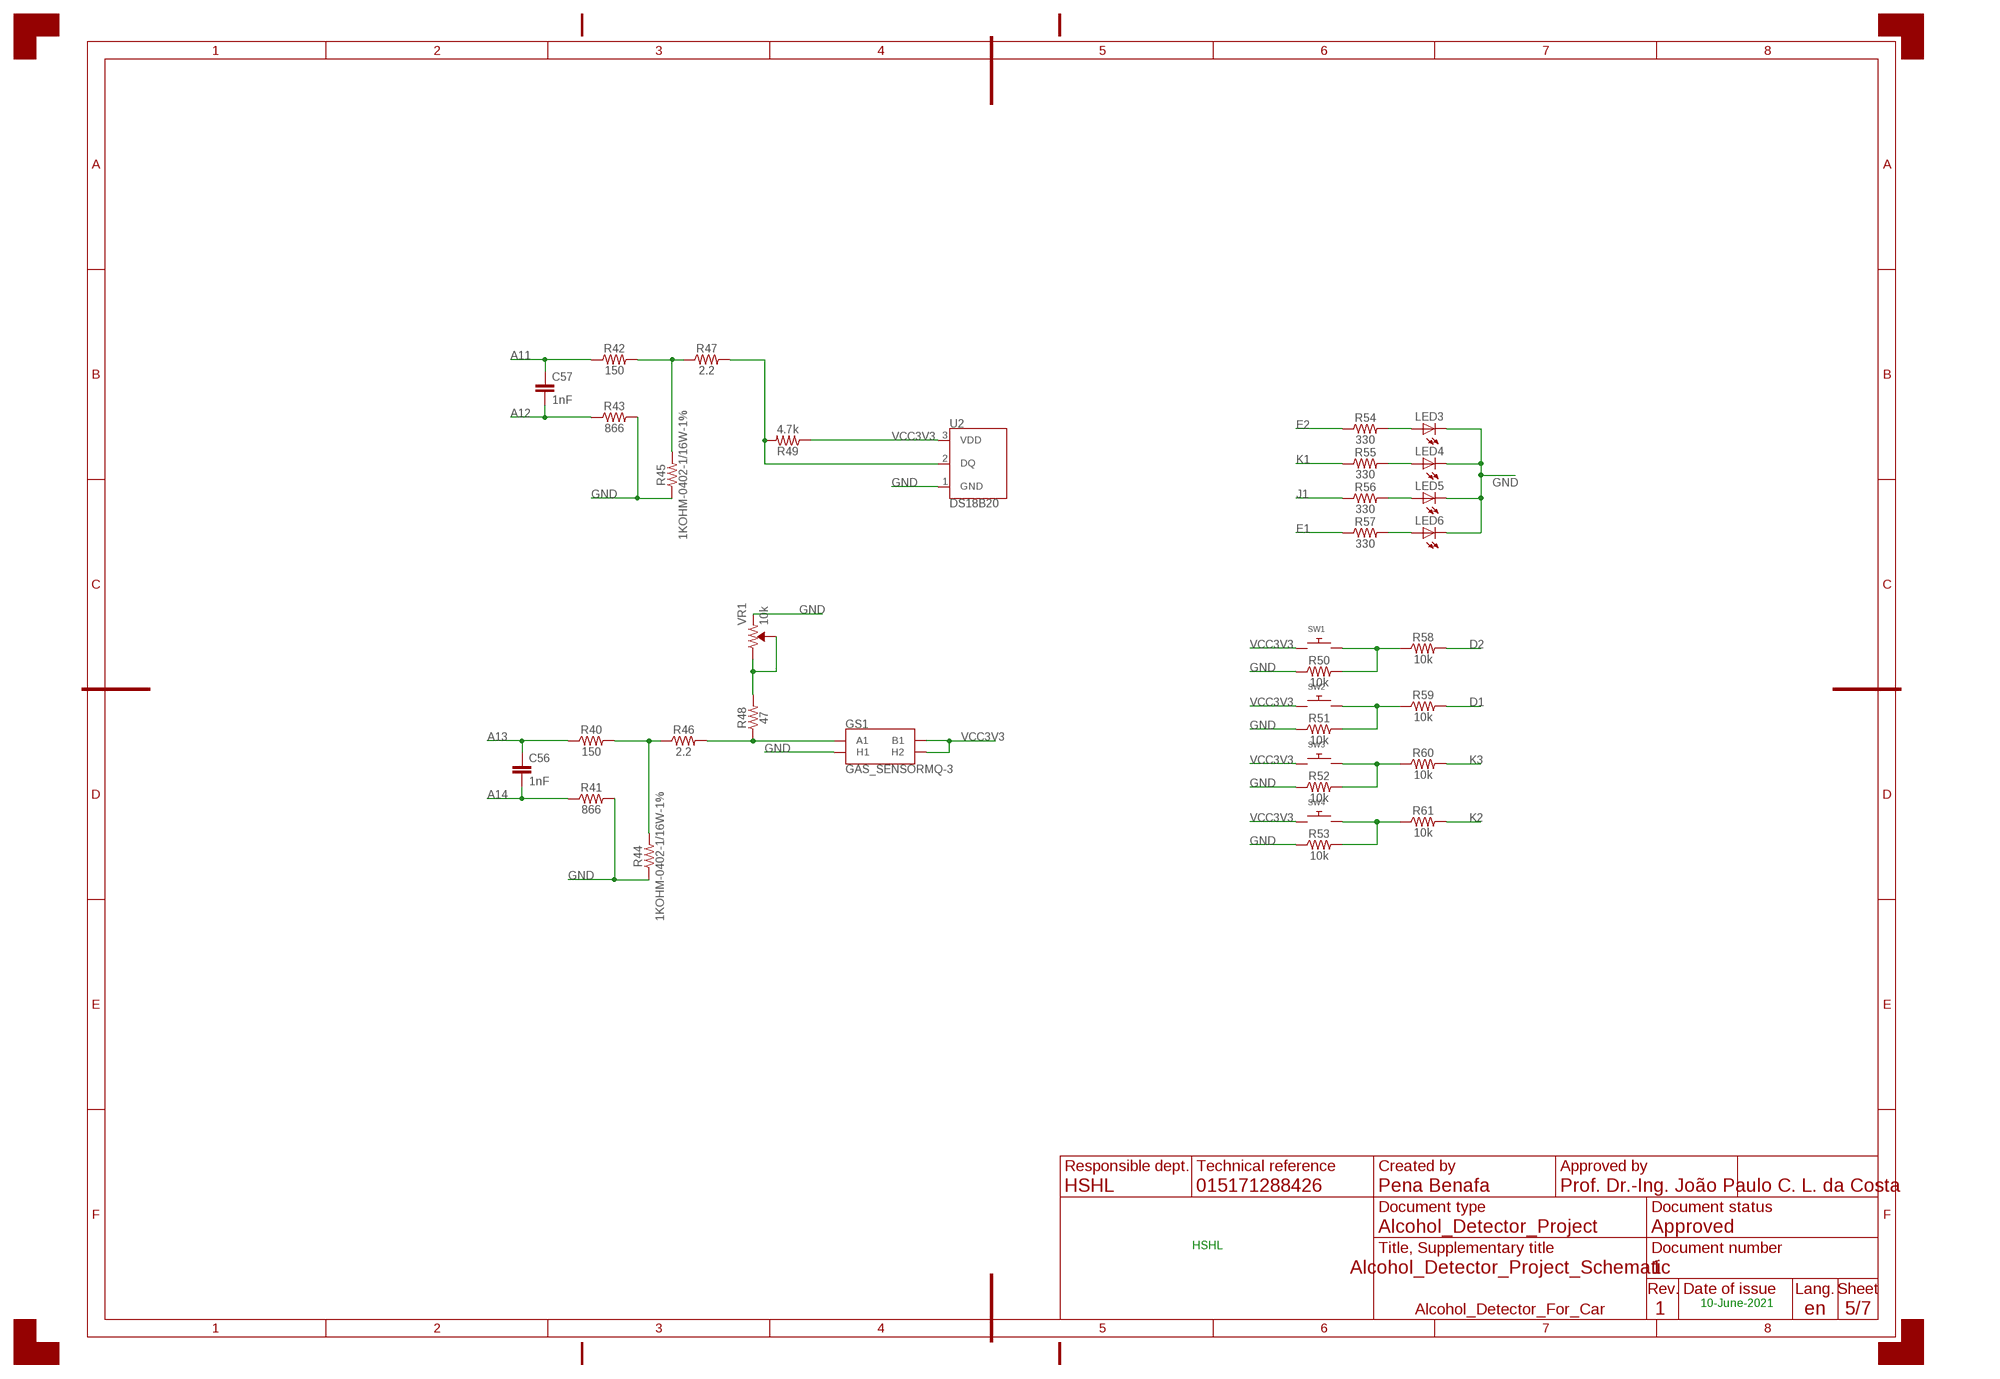
[diagram p4: schematic, sheet 5]
FRAME4 (A3_L_DOCFIELD_EN): APPROVAL_PERSON: Prof. Dr.-Ing. João Paulo C. L. da Costa; CREATOR: Pena Benafa; DOCUMENT_NUMBER: 1; DOCUMENT_STATUS: Approved; DOCUMENT_TYPE: Alcohol_Detector_Project; LANGUAGE: en; RESPONSIBLE_DEPARTMENT: HSHL; REVISION_LEVEL: 1; SUPPLEMENTARY_TITLE: Alcohol_Detector_For_Car; TECHNICAL_REFERENCE: 015171288426

### Parts
C56  1nF  1.0NF/1000PF-0402-25V-10%-X7R  [0402]
C57  1nF  1.0NF/1000PF-0402-25V-10%-X7R  [0402]
GS1  GAS_SENSORMQ-3  [GAS_SENSOR]
LED3  LEDB152  [Q62902-B152]
LED4  LEDB152  [Q62902-B152]
LED5  LEDB152  [Q62902-B152]
LED6  LEDB152  [Q62902-B152]
R40  150  150OHM-0603-1/10W-1%  [0603]
R41  866  866OHM-0603-1/10W-1%  [0603]
R42  150  150OHM-0603-1/10W-1%  [0603]
R43  866  866OHM-0603-1/10W-1%  [0603]
R44  1KOHM-0402-1/16W-1%  [0402]
R45  1KOHM-0402-1/16W-1%  [0402]
R46  2.2  2.2OHM-0603-1/10W-5%  [0603]
R47  2.2  2.2OHM-0603-1/10W-5%  [0603]
R48  47  47OHM-0603-1/10W-1%  [0603]
R49  4.7k  4.7KOHM-0402T-1/16W-1%  [0402-TIGHT]
R50  10k  10KOHM-0402-1/16W-1%  [0402]
R51  10k  10KOHM-0402-1/16W-1%  [0402]
R52  10k  10KOHM-0402-1/16W-1%  [0402]
R53  10k  10KOHM-0402-1/16W-1%  [0402]
R54  330  330OHM-0402-1/16W-5%  [0402]
R55  330  330OHM-0402-1/16W-5%  [0402]
R56  330  330OHM-0402-1/16W-5%  [0402]
R57  330  330OHM-0402-1/16W-5%  [0402]
R58  10k  10KOHM-0402-1/16W-1%  [0402]
R59  10k  10KOHM-0402-1/16W-1%  [0402]
R60  10k  10KOHM-0402-1/16W-1%  [0402]
R61  10k  10KOHM-0402-1/16W-1%  [0402]
SW1  SWITCH_PUSHBUTTONC&K_KSS  [BTN_CK_KSS]
SW2  SWITCH_PUSHBUTTONC&K_KSS  [BTN_CK_KSS]
SW3  SWITCH_PUSHBUTTONC&K_KSS  [BTN_CK_KSS]
SW4  SWITCH_PUSHBUTTONC&K_KSS  [BTN_CK_KSS]
U2  DS18B20  [TO-92-AMMO]
VR1  10k  TRIMPOT-PTH-10MM-KNOB-1/2W-10%  [TRIMPOT-PTH-3386U]

### Nets
A11: C57.1 R42.1 ; also sheet 1
A12: C57.2 R43.1 ; also sheet 1
A13: C56.1 R40.1 ; also sheet 1
A14: C56.2 R41.1 ; also sheet 1
D1: R59.2 ; also sheet 1
D2: R58.2 ; also sheet 1
E1: R57.1 ; also sheet 1
E2: R54.1 ; also sheet 1
GND: GS1.HA(H1) LED3.K(C) LED4.K(C) LED5.K(C) LED6.K(C) R41.2 R43.2 R44.1 R45.1 R50.1 R51.1 R52.1 R53.1 U2.1(GND) VR1.1(CCW) ; also sheet 1,2,3,4,6,7
J1: R56.1 ; also sheet 1
K1: R55.1 ; also sheet 1
K2: R61.2 ; also sheet 1
K3: R60.2 ; also sheet 1
N$14: GS1.A1 R46.2 R48.1
N$18: R42.2 R45.2 R47.1
N$19: R40.2 R44.2 R46.1
N$20: R50.2 R58.1 SW1.P$2
N$21: LED3.A R54.2
N$22: R51.2 R59.1 SW2.P$2
N$23: R48.2 VR1.2(WIPER) VR1.3(CW)
N$24: LED4.A R55.2
N$26: R52.2 R60.1 SW3.P$2
N$27: LED5.A R56.2
N$28: R47.2 R49.2 U2.2(DQ)
N$29: R53.2 R61.1 SW4.P$2
N$30: LED6.A R57.2
VCC3V3: GS1.B1 GS1.HB(H2) R49.1 SW1.P$1 SW2.P$1 SW3.P$1 SW4.P$1 U2.3(VDD) ; also sheet 1,2,3,4,6,7

### Notes on the sheet
- HSHL
- 10-June-2021

## Sheet 6 of 7
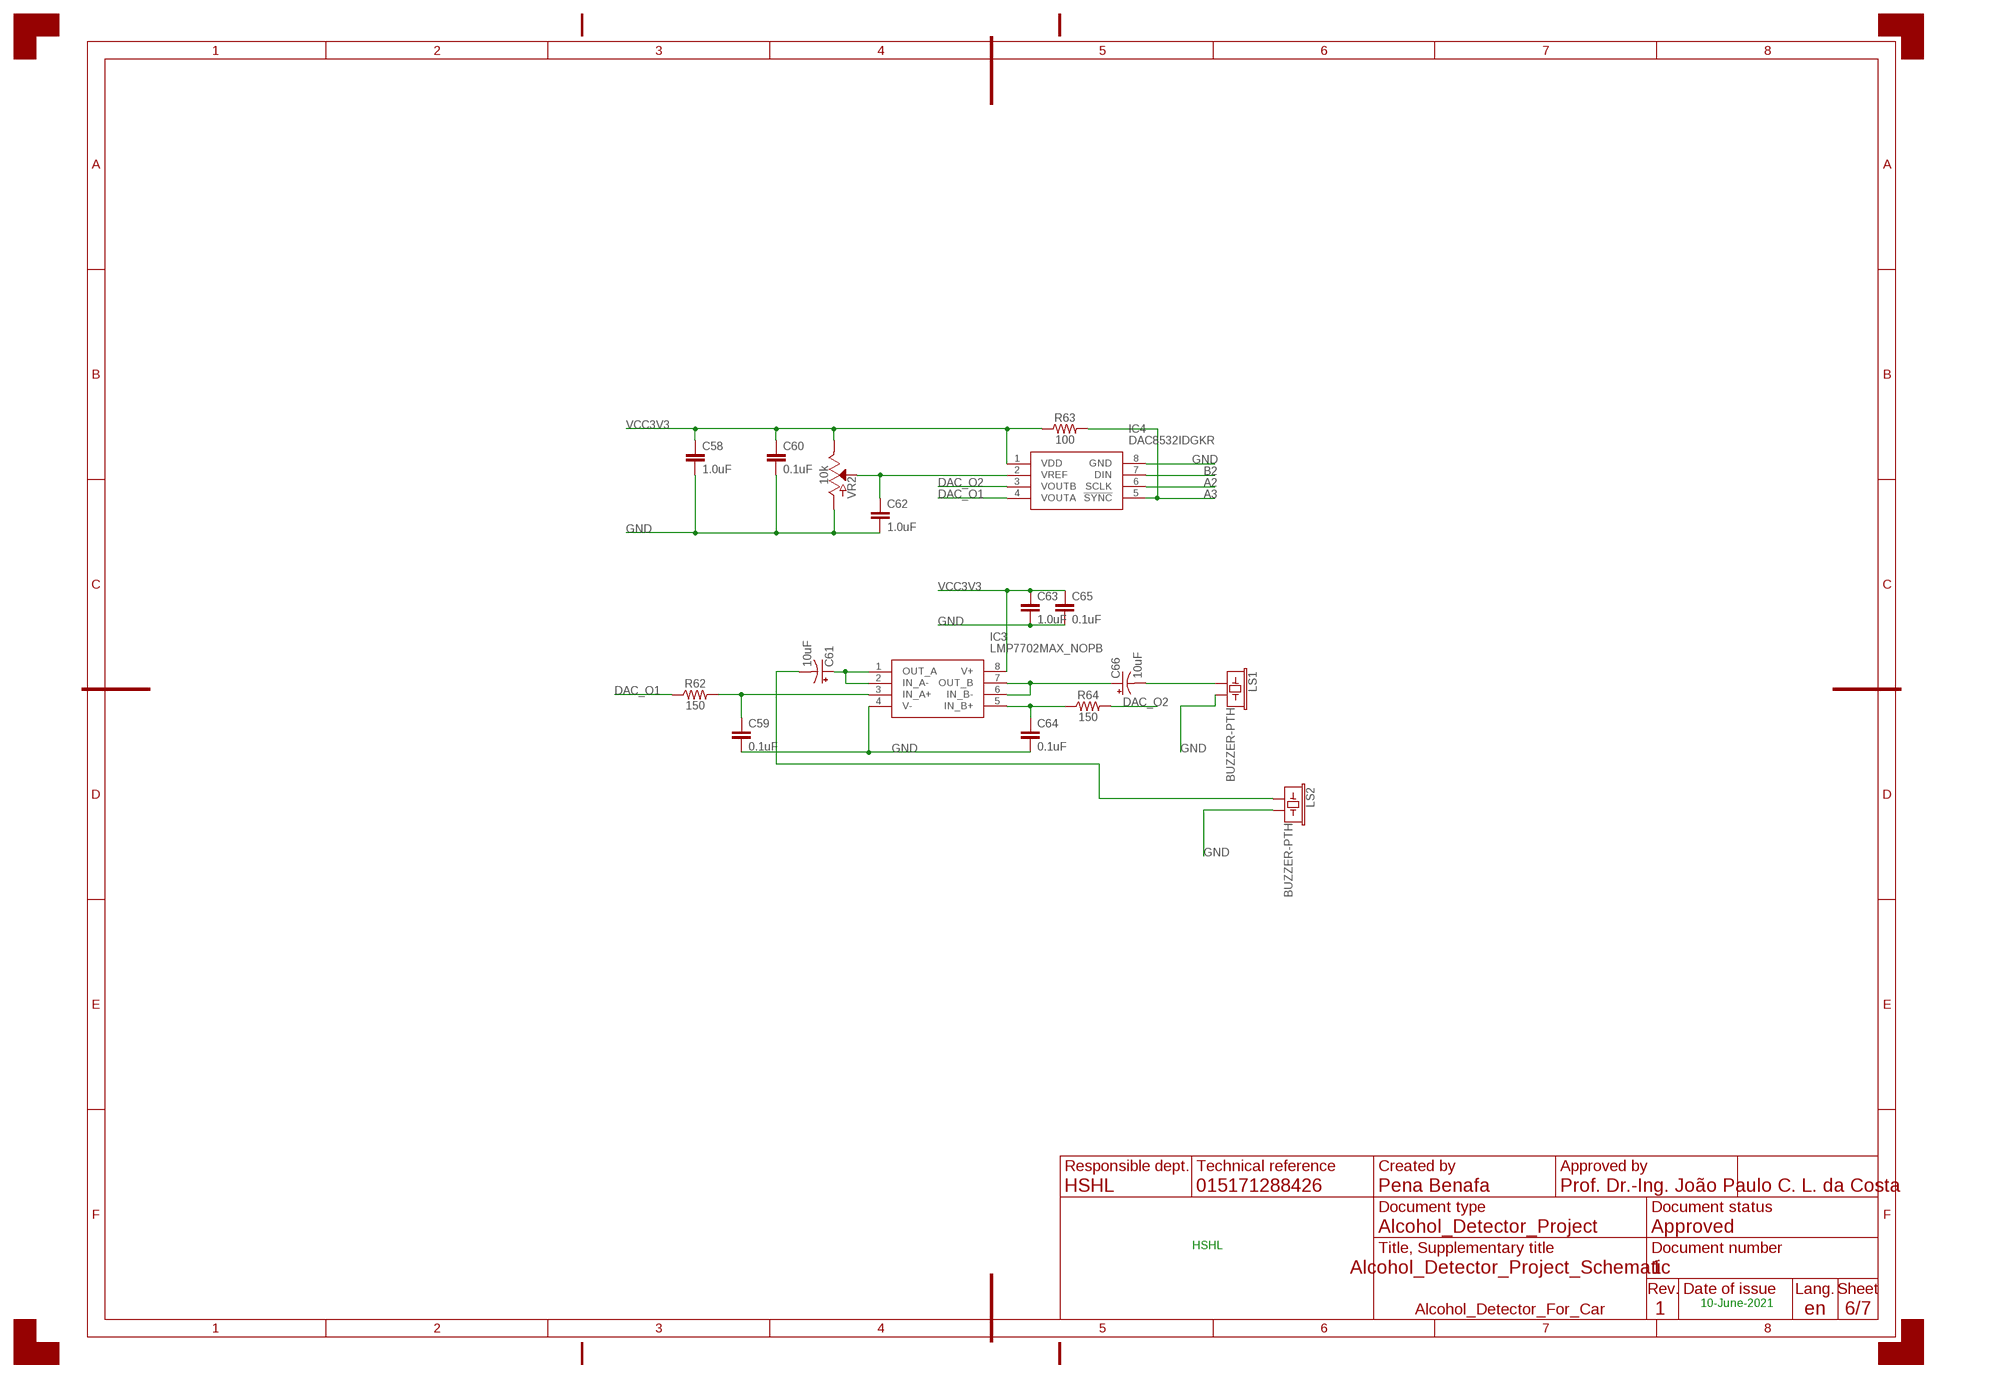
[diagram p5: schematic, sheet 6]
FRAME5 (A3_L_DOCFIELD_EN): APPROVAL_PERSON: Prof. Dr.-Ing. João Paulo C. L. da Costa; CREATOR: Pena Benafa; DOCUMENT_NUMBER: 1; DOCUMENT_STATUS: Approved; DOCUMENT_TYPE: Alcohol_Detector_Project; LANGUAGE: en; RESPONSIBLE_DEPARTMENT: HSHL; REVISION_LEVEL: 1; SUPPLEMENTARY_TITLE: Alcohol_Detector_For_Car; TECHNICAL_REFERENCE: 015171288426

### Parts
C58  1.0uF  1.0UF-0402-16V-10%  [0402]
C59  0.1uF  0.1UF-0402-6.3V-10%-X7R  [0402]
C60  0.1uF  0.1UF-0402-6.3V-10%-X7R  [0402]
C61  10uF  10UF-POLAR-0603-6.3V-20%(TANT)  [0603-POLAR]
C62  1.0uF  1.0UF-0402-16V-10%  [0402]
C63  1.0uF  1.0UF-0402-16V-10%  [0402]
C64  0.1uF  0.1UF-0402-6.3V-10%-X7R  [0402]
C65  0.1uF  0.1UF-0402-6.3V-10%-X7R  [0402]
C66  10uF  10UF-POLAR-0603-6.3V-20%(TANT)  [0603-POLAR]
IC3  LMP7702MAX_NOPB  [SOIC127P600X175-8N]
IC4  DAC8532IDGKR  [SOP65P490X110-8N]
LS1  BUZZER-PTH  [BUZZER-12MM]
LS2  BUZZER-PTH  [BUZZER-12MM]
R62  150  150OHM-0603-1/10W-1%  [0603]
R63  100  100OHM-0603-1/10W-1%  [0603]
R64  150  150OHM-0603-1/10W-1%  [0603]
VR2  10k  POTENTIOMETER_SLIDE-20MM-1/10W-20%  [SLIDER-SMALL]

### Nets
A2: IC4.6(SCLK) ; also sheet 1
A3: IC4.5(!SYNC) R63.2 ; also sheet 1
B2: IC4.7(DIN) ; also sheet 1
DAC_O1: IC4.4(VOUTA) R62.1
DAC_O2: IC4.3(VOUTB) R64.2
GND: C58.2 C59.2 C60.2 C62.2 C63.2 C64.2 C65.2 IC3.4(V-) IC4.8(GND) LS1.- LS2.- VR2.BOTTOM(A) ; also sheet 1,2,3,4,5,7
N$25: C62.1 IC4.2(VREF) VR2.WIPER(S)
N$31: C66.+ IC3.6(IN_B-) IC3.7(OUT_B)
N$33: C64.1 IC3.5(IN_B+) R64.1
N$34: C59.1 IC3.3(IN_A+) R62.2
N$35: C61.+ IC3.1(OUT_A) IC3.2(IN_A-)
N$36: C66.- LS1.+
N$39: C61.- LS2.+
VCC3V3: C58.1 C60.1 C63.1 C65.1 IC3.8(V+) IC4.1(VDD) R63.1 VR2.TOP(E) ; also sheet 1,2,3,4,5,7

### Notes on the sheet
- HSHL
- 10-June-2021

## Sheet 7 of 7
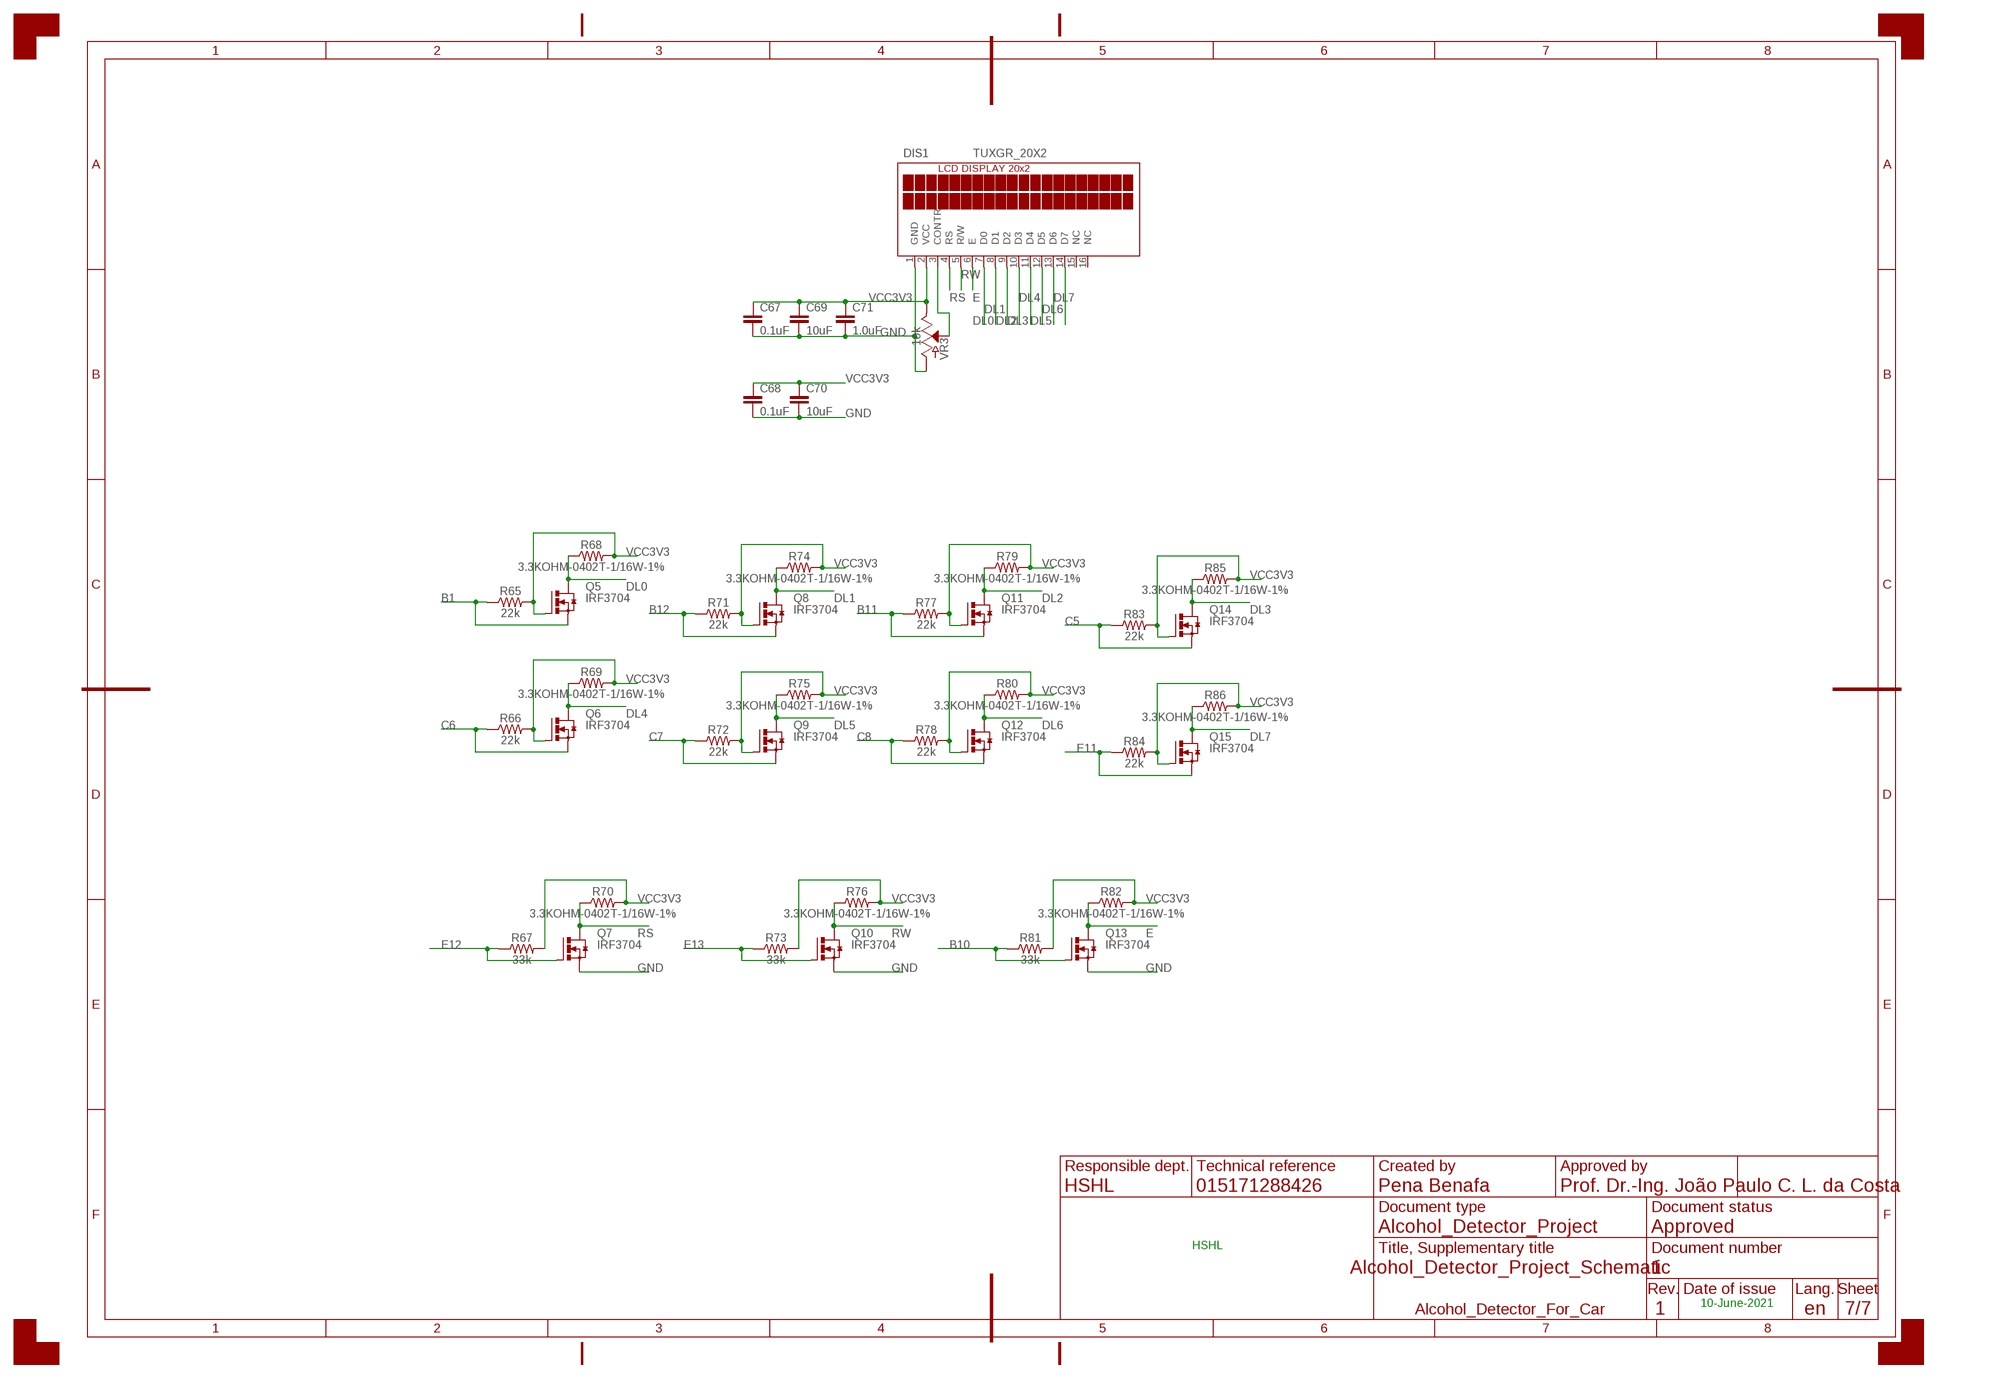
[diagram p6: schematic, sheet 7]
FRAME6 (A3_L_DOCFIELD_EN): APPROVAL_PERSON: Prof. Dr.-Ing. João Paulo C. L. da Costa; CREATOR: Pena Benafa; DOCUMENT_NUMBER: 1; DOCUMENT_STATUS: Approved; DOCUMENT_TYPE: Alcohol_Detector_Project; LANGUAGE: en; RESPONSIBLE_DEPARTMENT: HSHL; REVISION_LEVEL: 1; SUPPLEMENTARY_TITLE: Alcohol_Detector_For_Car; TECHNICAL_REFERENCE: 015171288426

### Parts
C67  0.1uF  0.1UF-0402-6.3V-10%-X7R  [0402]
C68  0.1uF  0.1UF-0402-6.3V-10%-X7R  [0402]
C69  10uF  10UF-0402T-6.3V-20%  [0402-TIGHT]
C70  10uF  10UF-0402T-6.3V-20%  [0402-TIGHT]
C71  1.0uF  1.0UF-0402-16V-10%  [0402]
DIS1  TUXGR_20X2  [TUXGR_20X2]
Q5  IRF3704  [TO220AH]
Q6  IRF3704  [TO220AH]
Q7  IRF3704  [TO220AH]
Q8  IRF3704  [TO220AH]
Q9  IRF3704  [TO220AH]
Q10  IRF3704  [TO220AH]
Q11  IRF3704  [TO220AH]
Q12  IRF3704  [TO220AH]
Q13  IRF3704  [TO220AH]
Q14  IRF3704  [TO220AH]
Q15  IRF3704  [TO220AH]
R65  22k  22KOHM-0402_TIGHT-1/10W-1%  [0402-TIGHT]
R66  22k  22KOHM-0402_TIGHT-1/10W-1%  [0402-TIGHT]
R67  33k  33KOHM-0402T-1/16W-1%  [0402-TIGHT]
R68  3.3KOHM-0402T-1/16W-1%  [0402-TIGHT]
R69  3.3KOHM-0402T-1/16W-1%  [0402-TIGHT]
R70  3.3KOHM-0402T-1/16W-1%  [0402-TIGHT]
R71  22k  22KOHM-0402_TIGHT-1/10W-1%  [0402-TIGHT]
R72  22k  22KOHM-0402_TIGHT-1/10W-1%  [0402-TIGHT]
R73  33k  33KOHM-0402T-1/16W-1%  [0402-TIGHT]
R74  3.3KOHM-0402T-1/16W-1%  [0402-TIGHT]
R75  3.3KOHM-0402T-1/16W-1%  [0402-TIGHT]
R76  3.3KOHM-0402T-1/16W-1%  [0402-TIGHT]
R77  22k  22KOHM-0402_TIGHT-1/10W-1%  [0402-TIGHT]
R78  22k  22KOHM-0402_TIGHT-1/10W-1%  [0402-TIGHT]
R79  3.3KOHM-0402T-1/16W-1%  [0402-TIGHT]
R80  3.3KOHM-0402T-1/16W-1%  [0402-TIGHT]
R81  33k  33KOHM-0402T-1/16W-1%  [0402-TIGHT]
R82  3.3KOHM-0402T-1/16W-1%  [0402-TIGHT]
R83  22k  22KOHM-0402_TIGHT-1/10W-1%  [0402-TIGHT]
R84  22k  22KOHM-0402_TIGHT-1/10W-1%  [0402-TIGHT]
R85  3.3KOHM-0402T-1/16W-1%  [0402-TIGHT]
R86  3.3KOHM-0402T-1/16W-1%  [0402-TIGHT]
VR3  10k  POTENTIOMETER_SLIDE-20MM-1/10W-20%  [SLIDER-SMALL]

### Nets
B1: Q5.E(S) R65.1 ; also sheet 1
B10: Q13.B(G) R81.1 ; also sheet 1
B11: Q11.E(S) R77.1 ; also sheet 1
B12: Q8.E(S) R71.1 ; also sheet 1
C5: Q14.E(S) R83.1 ; also sheet 1
C6: Q6.E(S) R66.1 ; also sheet 1
C7: Q9.E(S) R72.1 ; also sheet 1
C8: Q12.E(S) R78.1 ; also sheet 1
DL0: DIS1.7(D0) Q5.C(D) R68.1
DL1: DIS1.8(D1) Q8.C(D) R74.1
DL2: DIS1.9(D2) Q11.C(D) R79.1
DL3: DIS1.10(D3) Q14.C(D) R85.1
DL4: DIS1.11(D4) Q6.C(D) R69.1
DL5: DIS1.12(D5) Q9.C(D) R75.1
DL6: DIS1.13(D6) Q12.C(D) R80.1
DL7: DIS1.14(D7) Q15.C(D) R86.1
E: DIS1.6(E) Q13.C(D) R82.1
E11: Q15.E(S) R84.1 ; also sheet 1
E12: Q7.B(G) R67.1 ; also sheet 1
E13: Q10.B(G) R73.1 ; also sheet 1
GND: C67.2 C68.2 C69.2 C70.2 C71.2 DIS1.1(GND) Q7.E(S) Q10.E(S) Q13.E(S) VR3.BOTTOM(A) ; also sheet 1,2,3,4,5,6
N$50: DIS1.3(CONTR) VR3.WIPER(S)
RS: DIS1.4(RS) Q7.C(D) R70.1
RW: DIS1.5(R/W) Q10.C(D) R76.1
VCC3V3: C67.1 C68.1 C69.1 C70.1 C71.1 DIS1.2(VCC) Q5.B(G) Q6.B(G) Q8.B(G) Q9.B(G) Q11.B(G) Q12.B(G) Q14.B(G) Q15.B(G) R65.2 R66.2 R67.2 R68.2 R69.2 R70.2 R71.2 R72.2 R73.2 R74.2 R75.2 R76.2 R77.2 R78.2 R79.2 R80.2 R81.2 R82.2 R83.2 R84.2 R85.2 R86.2 VR3.TOP(E) ; also sheet 1,2,3,4,5,6
Unconnected: DIS1.15(NC) DIS1.16(NC)

### Notes on the sheet
- HSHL
- 10-June-2021

## Library data of the parts
C1 C55 C59 C60 C64 C65 C67 C68 = SparkFun-Capacitors:0.1UF: 0.1µF ceramic capacitors A capacitor is a passive two-terminal electrical component used to store electrical energy temporarily in an electric field.; PROD_ID: CAP-14993
C2-C48 = capacitor-wima:C: CAPACITOR naming: grid - package width
C49 C54 C69 C70 = SparkFun-Capacitors:10UF: 10.0µF ceramic capacitors A capacitor is a passive two-terminal electrical component used to store electrical energy temporarily in an electric field.; PROD_ID: CAP-14848
C50 C51 C53 = SparkFun-Capacitors:20PF: 20pF ceramic capacitors A capacitor is a passive two-terminal electrical component used to store electrical energy temporarily in an electric field.; PROD_ID: CAP-14843
C52 = SparkFun-Capacitors:22UF: 22µF ceramic capacitors A capacitor is a passive two-terminal electrical component used to store electrical energy temporarily in an electric field.; PROD_ID: CAP-14464
C56 C57 = SparkFun-Capacitors:1.0NF/1000PF: 1nF/1,000pF ceramic capacitors A capacitor is a passive two-terminal electrical component used to store electrical energy temporarily in an electric field.; PROD_ID: CAP-15061
C58 C62 C63 C71 = SparkFun-Capacitors:1.0UF: 1µF ceramic capacitors A capacitor is a passive two-terminal electrical component used to store electrical energy temporarily in an electric field.; PROD_ID: CAP-12417
C61 C66 = SparkFun-Capacitors:10UF-POLAR: 10.0µF polarized capacitors A capacitor is a passive two-terminal electrical component used to store electrical energy temporarily in an electric field.; PROD_ID: CAP-13210
D1 = SparkFun-DiscreteSemi:DIODE-ZENER: Zener Diode A Zener diode allows current to flow from its anode to its cathode like a normal semiconductor diode, but it also permits current to flow in the reverse direction when its "Zener voltage" is reached. - WIkipedia; PROD_ID: DIO-08199
DIS1 = display-lcd:TUXGR_20X2: Tuxgraphics LCD display 20x2 characters reflective, without background light Source: tuxgr_20x2.pdf; OC_FARNELL: unknown; OC_NEWARK: unknown
GS1 = SparkFun-Sensors:GAS_SENSOR: Gas Sensors - MQ-3, MQ-4, MQ-6, MQ-7, MQ-8 Through-hole gas sensors with a heating coil and an analog output. Example Datasheet <https://cdn.sparkfun.com/datasheets/Sensors/Biometric/MQ-3%20ver1.3%20-%20Manual.pdf> SparkFun Products Gas Sensor Breakout Board <https://www.sparkfun.com/products/8891> (BOB-8891) - Breakout board compatible with all gas sensors. Alcohol Gas Sensor - MQ-3 <https://www.sparkfun.com/products/8880> (SEN-08880) Methane CNG Gas Sensor - MQ-4 <https://www.sparkfun.com/products/9404> (SEN-09404) LPG Gas Sensor - MQ-6 <https://www.sparkfun.com/products/9405> (SEN-09405) Carbon Monoxide Sensor - MQ-7 <https://www.sparkfun.com/products/9403> (SEN-09403) Hydrogen Gas Sensor - MQ-8 <https://www.sparkfun.com/products/10916> (SEN-10916); PROD_ID: COMP-12216; SF_ID: SEN-08880
IC1 = XC7S25CSGA225-1C:XC7S25-1CSGA225I: XC7S25-1CSGA225I Source: Datasheet <https://www.xilinx.com/support/documentation/data_sheets/ds180_7Series_Overview.pdf>; DESCRIPTION: XC7S25-1CSGA225I; HEIGHT: 1.4mm; MANUFACTURER_NAME: XILINX; MANUFACTURER_PART_NUMBER: XC7S25-1CSGA225I
IC2 = LTC3569EUDC#TRPBF:LTC3569EUDC#TRPBF: Switching Voltage Regulators Programmable 1.2A and 2X600mA, Triple Buck Regulator Source: Datasheet <https://www.analog.com/media/en/technical-documentation/data-sheets/3569fe.pdf>; DESCRIPTION: Switching Voltage Regulators Programmable 1.2A and 2X600mA, Triple Buck Regulator; HEIGHT: 0.8mm; MANUFACTURER_NAME: Analog Devices; MANUFACTURER_PART_NUMBER: LTC3569EUDC#TRPBF
IC3 = LMP7702MAX_NOPB:LMP7702MAX_NOPB: Precision, CMOS Input, RRIO, Wide Supply Range Dual Amplifier Source: Datasheet <http://www.ti.com/lit/gpn/LMP7702>; DESCRIPTION: Precision, CMOS Input, RRIO, Wide Supply Range Dual Amplifier; HEIGHT: 1.75mm; MANUFACTURER_NAME: Texas Instruments; MANUFACTURER_PART_NUMBER: LMP7702MAX/NOPB; MOUSER_PART_NUMBER: 926-LMP7702MAX/NOPB; MOUSER_PRICE-STOCK: https://www.mouser.co.uk/ProductDetail/Texas-Instruments/LMP7702MAX-NOPB?qs=7lkVKPoqpbYtIAWRtzyoWQ%3D%3D
IC4 = DAC8532IDGKR:DAC8532IDGKR: 16-Bit, Dual Channel, Low Power D-to-A Converter W/ Serial I/F and Rail-to-Rail Voltage Output Source: Datasheet <http://www.ti.com/lit/gpn/DAC8532>; DESCRIPTION: 16-Bit, Dual Channel, Low Power D-to-A Converter W/ Serial I/F and Rail-to-Rail Voltage Output; HEIGHT: 1.1mm; MANUFACTURER_NAME: Texas Instruments; MANUFACTURER_PART_NUMBER: DAC8532IDGKR; MOUSER_PART_NUMBER: 595-DAC8532IDGKR; MOUSER_PRICE-STOCK: https://www.mouser.co.uk/ProductDetail/Texas-Instruments/DAC8532IDGKR?qs=vul0MlC%2Fa1cATiqpODe80A%3D%3D
JP1 = pinhead:PINHD-2X7: PIN HEADER
L1 L2 = inductors:P0762.*NL: Unshielded Drum Core P0762NL Series Source> http://ww2.pulseeng.com/products/datasheets/SPM2007.pdf; SPICEPREFIX: L
L3 = SparkFun-Coils:INDUCTOR: Inductors Resist changes in electrical current. Basically a coil of wire. SparkFun Products: SparkFun Load Cell Amplifier - HX711 <https://www.sparkfun.com/products/13879> IOIO-OTG - V2.2 <https://www.sparkfun.com/products/13613>; PROD_ID: NDUC-13076
L4 = SparkFun-Coils:1.5UH: FIXED IND 1.5UH 1.4A 120 MOHM; PROD_ID: NDUC-15405
L5 = SparkFun-Coils:INDUCTOR: Inductors Resist changes in electrical current. Basically a coil of wire. SparkFun Products: SparkFun Load Cell Amplifier - HX711 <https://www.sparkfun.com/products/13879> IOIO-OTG - V2.2 <https://www.sparkfun.com/products/13613>; PROD_ID: NDUC-14234
LED1-LED6 = adafruit:LED: LED OSRAM: - CHIPLED LG R971, LG N971, LY N971, LG Q971, LY Q971, LO R971, LY R971 LH N974, LH R974 LS Q976, LO Q976, LY Q976 LO Q996 - Hyper CHIPLED LW Q18S LB Q993, LB Q99A, LB R99A - SideLED LS A670, LO A670, LY A670, LG A670, LP A670 LB A673, LV A673, LT A673, LW A673 LH A674 LY A675 LS A676, LA A676, LO A676, LY A676, LW A676 LS A679, LY A679, LG A679 - Hyper Micro SIDELED® LS Y876, LA Y876, LO Y876, LY Y876 LT Y87S - SmartLED LW L88C, LW L88S LB L89C, LB L89S, LG L890 LS L89K, LO L89K, LY L89K LS L896, LA L896, LO L896, LY L896 - TOPLED LS T670, LO T670, LY T670, LG T670, LP T670 LSG T670, LSP T670, LSY T670, LOP T670, LYG T670 LG T671, LOG T671, LSG T671 LB T673, LV T673, LT T673, LW T673 LH T674 LS T676, LA T676, LO T676, LY T676, LB T676, LH T676, LSB T676, LW T676 LB T67C, LV T67C, LT T67C, LS T67K, LO T67K, LY T67K, LW E67C LS E67B, LA E67B, LO E67B, LY E67B, LB E67C, LV E67C, LT E67C LW T67C LS T679, LY T679, LG T679 LS T770, LO T770, LY T770, LG T770, LP T770 LB T773, LV T773, LT T773, LW T773 LH T774 LS E675, LA E675, LY E675, LS T675 LS T776, LA T776, LO T776, LY T776, LB T776 LHGB T686 LT T68C, LB T68C - Hyper Mini TOPLED® LB M676 - Mini TOPLED Santana® LG M470 LS M47K, LO M47K, LY M47K Source: http://www.osram.convergy.de/
LS1 LS2 = SparkFun-Electromechanical:BUZZER: Buzzer Small round buzzers that operate around the audible 2kHz range. You can use these as speakers to create simple music or user interfaces. Variant Overview: PTH - Mini Speaker - PC Mount 12mm 2.048kHz <https://www.sparkfun.com/products/7950> PTH_KIT - Mini Speaker - PC Mount 12mm 2.048kHz <https://www.sparkfun.com/products/7950> KIT simplifies soldering by adding stop mask to one side of the pads. PTH_NO_SILK - Mini Speaker - PC Mount 12mm 2.048kHz <https://www.sparkfun.com/products/7950> No silkscreen indicator of buzzer outline. PTH_KIT_NO_SILK - Mini Speaker - PC Mount 12mm 2.048kHz <https://www.sparkfun.com/products/7950> KIT package w/o silkscreen SMD - Buzzer Audio Magnetic (CCV-084B16) SMD buzzer used on, e.g. the LilyPad Buzzer <https://www.sparkfun.com/products/8463> and RFID USB Reader <https://www.sparkfun.com/products/9963>. SMD_KIT - Buzzer Audio Magnetic (CCV-084B16) SMD Buzzer with elongated pins to make soldering easier. Used on the SparkFun Simon Says - Surface Mount Soldering Kit <https://www.sparkfun.com/products/10935>. SMD-SQUARE - Buzzer Audio Magnetic (COMP-15701) SMT square buzzer with one chamfered corner.; PROD_ID: COMP-08253; SF_SKU: COM-07950
Q1 = semicon-smd-ipc:PNP-TRANSISTIOR-2COL: PNP TRANSISTOR 2 colletor pins
Q2 Q3 = semicon-smd-ipc:NPN-TRANSISTIOR-2COL: NPN TRANSISTOR 2 colletor pins
Q4-Q15 = transistor-power:IRF3704: SMPS MOSFET HEXFET® Power MOSFET Source: http://www.irf.com/product-info/datasheets/data/irf3704.pdf
R1 R11 = SparkFun-Resistors:0OHM: 0Ω resistor A resistor is a passive two-terminal electrical component that implements electrical resistance as a circuit element. Resistors act to reduce current flow, and, at the same time, act to lower voltage levels within circuits. - Wikipedia; PROD_ID: RES-14244
R2 R50-R53 R58-R61 = SparkFun-Resistors:10KOHM: 10kΩ resistor A resistor is a passive two-terminal electrical component that implements electrical resistance as a circuit element. Resistors act to reduce current flow, and, at the same time, act to lower voltage levels within circuits. - Wikipedia; PROD_ID: RES-14241
R3 R68-R70 R74-R76 R79 R80 R82 R85 R86 = SparkFun-Resistors:3.3KOHM: 3.3kΩ resistor A resistor is a passive two-terminal electrical component that implements electrical resistance as a circuit element. Resistors act to reduce current flow, and, at the same time, act to lower voltage levels within circuits. - Wikipedia; PROD_ID: RES-15923
R4 R7 R8 R10 = SparkFun-Resistors:120OHM: 120Ω resistor A resistor is a passive two-terminal electrical component that implements electrical resistance as a circuit element. Resistors act to reduce current flow, and, at the same time, act to lower voltage levels within circuits. - Wikipedia
R5 R16 = SparkFun-Resistors:124KOHM: 124kΩ resistor A resistor is a passive two-terminal electrical component that implements electrical resistance as a circuit element. Resistors act to reduce current flow, and, at the same time, act to lower voltage levels within circuits. - Wikipedia; PROD_ID: RES-14395
R6 = SparkFun-Resistors:150KOHM: 150kΩ resistor A resistor is a passive two-terminal electrical component that implements electrical resistance as a circuit element. Resistors act to reduce current flow, and, at the same time, act to lower voltage levels within circuits. - Wikipedia; PROD_ID: RES-15093
R9 = SparkFun-Resistors:22OHM: 22Ω resistor A resistor is a passive two-terminal electrical component that implements electrical resistance as a circuit element. Resistors act to reduce current flow, and, at the same time, act to lower voltage levels within circuits. - Wikipedia; PROD_ID: RES-12427
R12 R15 R17 R20 = SparkFun-Resistors:100KOHM: 100kΩ resistor A resistor is a passive two-terminal electrical component that implements electrical resistance as a circuit element. Resistors act to reduce current flow, and, at the same time, act to lower voltage levels within circuits. - Wikipedia; PROD_ID: RES-13495
R13 R23 R24 R26 R27 R44 R45 = SparkFun-Resistors:1KOHM: 1kΩ resistor A resistor is a passive two-terminal electrical component that implements electrical resistance as a circuit element. Resistors act to reduce current flow, and, at the same time, act to lower voltage levels within circuits. - Wikipedia; PROD_ID: RES-14342
R14 = SparkFun-Resistors:30.1KOHM: 30.1kΩ resistor A resistor is a passive two-terminal electrical component that implements electrical resistance as a circuit element. Resistors act to reduce current flow, and, at the same time, act to lower voltage levels within circuits. - Wikipedia; PROD_ID: RES-14417
R18 = SparkFun-Resistors:180KOHM: RES-10066; PROD_ID: RES-10066
R19 = SparkFun-Resistors:57.6KOHM: 57.6 kΩ resistor A resistor is a passive two-terminal electrical component that implements electrical resistance as a circuit element. Resistors act to reduce current flow, and, at the same time, act to lower voltage levels within circuits. - Wikipedia; PROD_ID: RES-15818
R21 = SparkFun-Resistors:680OHM: 680Ω resistor A resistor is a passive two-terminal electrical component that implements electrical resistance as a circuit element. Resistors act to reduce current flow, and, at the same time, act to lower voltage levels within circuits. - Wikipedia; PROD_ID: RES-09333
R22 R30 R34 R36 R37 R63 = SparkFun-Resistors:100OHM: 100Ω resistor A resistor is a passive two-terminal electrical component that implements electrical resistance as a circuit element. Resistors act to reduce current flow, and, at the same time, act to lower voltage levels within circuits. - Wikipedia; PROD_ID: RES-07863
R25 R28 R31-R33 R49 = SparkFun-Resistors:4.7KOHM: 4.7kΩ resistor A resistor is a passive two-terminal electrical component that implements electrical resistance as a circuit element. Resistors act to reduce current flow, and, at the same time, act to lower voltage levels within circuits. - Wikipedia; PROD_ID: RES-15343
R29 = SparkFun-Resistors:200OHM: 200Ω resistor A resistor is a passive two-terminal electrical component that implements electrical resistance as a circuit element. Resistors act to reduce current flow, and, at the same time, act to lower voltage levels within circuits. - Wikipedia; PROD_ID: RES-15550
R35 R38 = SparkFun-Resistors:1.8KOHM: 1.8kΩ resistor A resistor is a passive two-terminal electrical component that implements electrical resistance as a circuit element. Resistors act to reduce current flow, and, at the same time, act to lower voltage levels within circuits. - Wikipedia; PROD_ID: RES-09119
R39 R48 = SparkFun-Resistors:47OHM: 47Ω resistor A resistor is a passive two-terminal electrical component that implements electrical resistance as a circuit element. Resistors act to reduce current flow, and, at the same time, act to lower voltage levels within circuits. - Wikipedia; PROD_ID: RES-14282
R40 R42 R62 R64 = SparkFun-Resistors:150OHM: 150Ω resistor A resistor is a passive two-terminal electrical component that implements electrical resistance as a circuit element. Resistors act to reduce current flow, and, at the same time, act to lower voltage levels within circuits. - Wikipedia; PROD_ID: RES-11028
R41 R43 = SparkFun-Resistors:866OHM: 866Ω resistor A resistor is a passive two-terminal electrical component that implements electrical resistance as a circuit element. Resistors act to reduce current flow, and, at the same time, act to lower voltage levels within circuits. - Wikipedia; PROD_ID: RES-09991
R46 R47 = SparkFun-Resistors:2.2OHM: 2.2Ω resistor A resistor is a passive two-terminal electrical component that implements electrical resistance as a circuit element. Resistors act to reduce current flow, and, at the same time, act to lower voltage levels within circuits. - Wikipedia; PROD_ID: RES-07823
R54-R57 = SparkFun-Resistors:330OHM: 330Ω resistor A resistor is a passive two-terminal electrical component that implements electrical resistance as a circuit element. Resistors act to reduce current flow, and, at the same time, act to lower voltage levels within circuits. - Wikipedia; PROD_ID: RES-15407
R65 R66 R71 R72 R77 R78 R83 R84 = SparkFun-Resistors:22KOHM: 22kΩ resistor A resistor is a passive two-terminal electrical component that implements electrical resistance as a circuit element. Resistors act to reduce current flow, and, at the same time, act to lower voltage levels within circuits. - Wikipedia; PROD_ID: RES-14281
R67 R73 R81 = SparkFun-Resistors:33KOHM: 33kΩ resistor A resistor is a passive two-terminal electrical component that implements electrical resistance as a circuit element. Resistors act to reduce current flow, and, at the same time, act to lower voltage levels within circuits. - Wikipedia; PROD_ID: RES-15128
SW1-SW4 = adafruit:SWITCH_PUSHBUTTON: Buttons SOFTTOUCHSMD_SJ - Soft touch temporary push button (Super Junk Akihabara) Compatible with SKPMANE010 [Mouser: 688-SKPMAN] C&K_KSS = Digikey: KSS221GLFS
U1 = SparkFun-IC-Memory:W25Q32FV: W25Q32FV 32Mb (4MB) Serial Flash Memory The W25Q32FV support the standard Serial Peripheral Interface (SPI), Dual/Quad I/O SPI as well as 2-clocks instruction cycle Quad Peripheral Interface (QPI). 104MHz, SPI, 8-SOIC-EIAJ Datasheet <http://www.winbond.com/resource-files/w25q32fv%20revh%20091613.pdf> SparkFun Products SparkFun Blynk Board - ESP8266 <https://www.sparkfun.com/products/13794> (WRL-13794); PROD_ID: IC-13229
U2 = SparkFun-Sensors:DS18B20: Dallas/Maxim DS18B20 1-Wire Temperature Sensor The DS18B20 reports degrees C with 9 to 12-bit precision, -55C to 125C (+/-0.5C). Each sensor has a unique 64-Bit Serial number etched into it - allows for a huge number of sensors to be used on one data bus. Datasheet <http://datasheets.maximintegrated.com/en/ds/DS18B20.pdf> SparkFun Products One Wire Digital Temperature Sensor - DS18B20 <https://www.sparkfun.com/products/245> (SEN-00245); STORE_ID: SEN-00245
VR1 = SparkFun-Resistors:TRIMPOT: Trimming Potentiometer (Trimpot) Three-terminal potentiometers, with an adjustable wiper and two adjustable resistors. A pot can be used to create a configurable voltage divider, or as a variable resistor. "Trimpots" are a subset of potentiometers, usually intended for "set-and-forget" applications. They're often more delicate than standard potentiometers - rated for fewer turns. Variants PTH-KNOB - PTH Trimpot w/ finger-adjustable knob Trimpot 10K with Knob <https://www.sparkfun.com/products/9806> (COM-09806) Datasheet <http://www.sparkfun.com/datasheets/Components/General/TSR-3386.pdf> SMD-3MM-CLOSED-FRAME - SMD 3mm Square Closed-Frame Trimpot Used on e.g. EasyDriver - Stepper Motor Driver <https://www.sparkfun.com/products/12779> Datasheet <http://www.bitechnologies.com/pdfs/22.pdf> (22AR10KTR) SMD-5MM - SMD 5mm Square Closed-Frame Trimpot Used on e.g. IOIO-OTG - V2.2 <https://www.sparkfun.com/products/13613> Datasheet <http://www.vishay.com/docs/51008/ts53.pdf> (TS53YL502MR10) SMD-3MM-1/10W-25% - 3mm Square Open-Frame Trimpot Used on e.g. SparkFun Shapeoko <https://www.sparkfun.com/products/13899> Datasheet <http://www.bourns.com/docs/Product-Datasheets/TC33.pdf> (TC33X-2-103E); PROD_ID: RES-09730; SF_SKU: COM-09806
VR2 VR3 = SparkFun-Resistors:POTENTIOMETER_SLIDE: Slide Potentiometer Slide-type potentiometers - pots that are adjusted by sliding a wiper up or down. Commonly found en-masse on sound boards. Variants 60MM - Slide Pot - X-Large (10k Linear Taper) <https://www.sparkfun.com/products/9119> (COM-09119) 10k linear slide pot with 60mm travel. Datasheet <http://cdn.sparkfun.com/datasheets/Components/Switches/SC608N-b10k.pdf> 30MM, 30MM-KIT - Slide Pot - Medium (10k Linear Taper) <https://www.sparkfun.com/products/11621> (COM-11621) 10k linear slide pot with 30mm travel. Datasheet <http://cdn.sparkfun.com/datasheets/Components/Switches/C-31-.pdf> (C3031N-1A2-B10K-GP) "KIT" variant, intended for soldering kits, has tStop removed from pads so the component can only be stuffed on one side of the board. 20MM - Slide Pot - Small (10k Linear Taper) <https://www.sparkfun.com/products/11620> (COM-11620) 10k linear slide pot with 20mm travel. Datasheet <http://cdn.sparkfun.com/datasheets/Components/Switches/C-31-.pdf> (C2031N-1A2-B10K-GP); PROD_ID: RES-11924; SF_SKU: COM-11620
Y1 = SG-210STF_12.0000ML3:SG-210STF_12.0000ML3: Standard Clock Oscillators 12MHz 50ppm -40C +85C Source: Datasheet <https://componentsearchengine.com/Datasheets/1/SG-210STF 12.0000ML3.pdf>; DESCRIPTION: Standard Clock Oscillators 12MHz 50ppm -40C +85C; HEIGHT: 0.9mm; MANUFACTURER_NAME: Epson Timing; MANUFACTURER_PART_NUMBER: SG-210STF 12.0000ML3; MOUSER_PART_NUMBER: 732-SG210STF12.0L3; MOUSER_PRICE-STOCK: https://www.mouser.co.uk/ProductDetail/Epson-Timing/SG-210STF-120000ML3?qs=6J2kD0vu%2F2X8UW2dsKN8zA%3D%3D